# EAGLE schematic Welder_PSU_Backup (EAGLE 9.6.2)

## Sheet 1 of 4
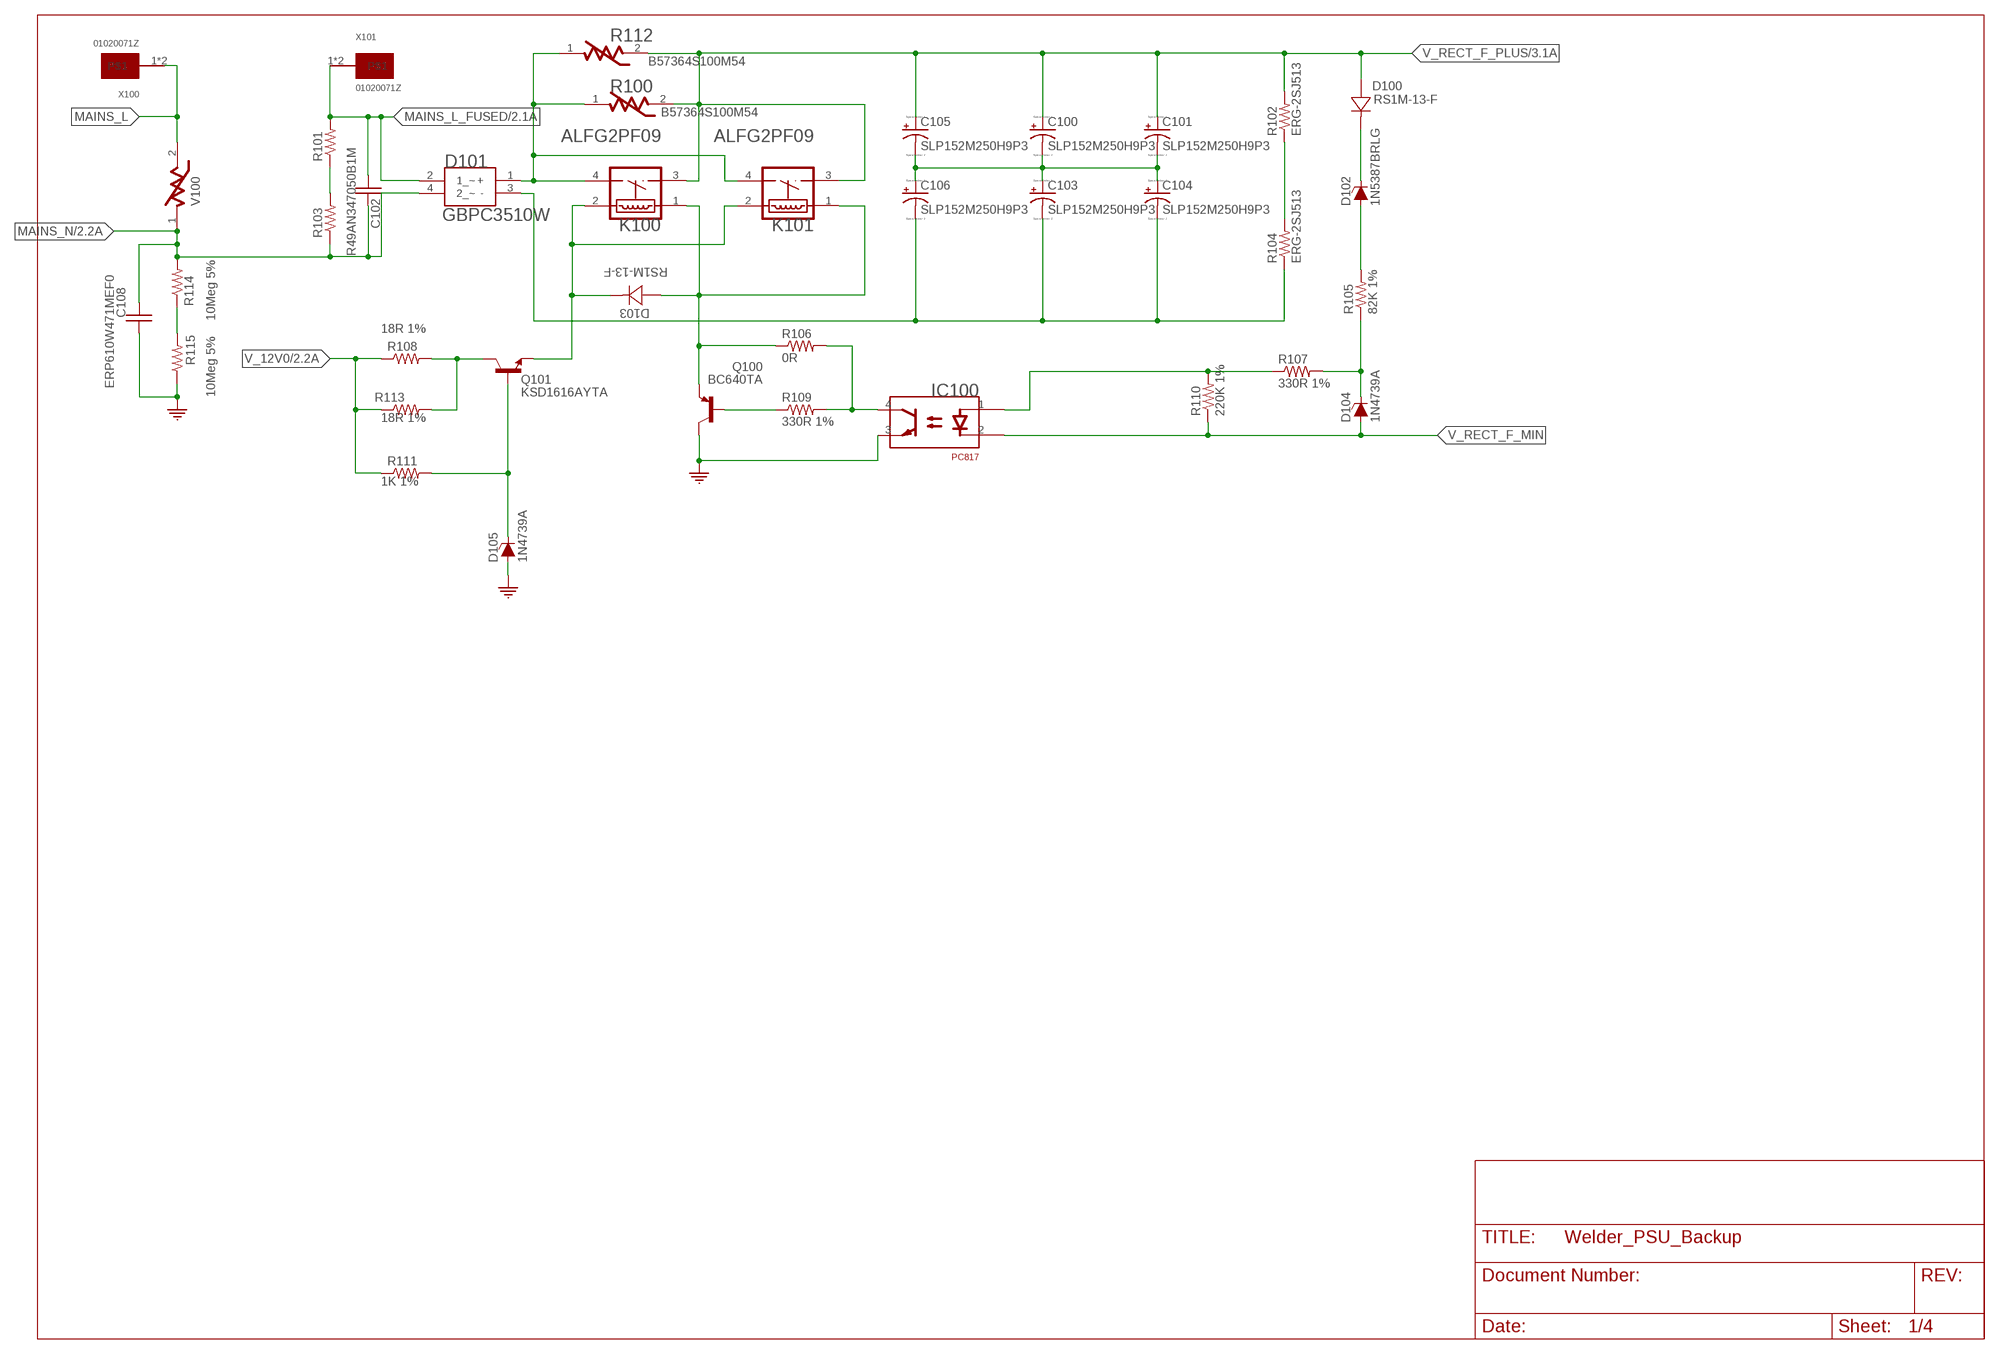
[diagram p0: schematic, sheet 1]

### Parts
C100  SLP152M250H9P3  [CAPACITOR-ELKO-400V-RM10-35X50]
C101  SLP152M250H9P3  [CAPACITOR-ELKO-400V-RM10-35X50]
C102  R49AN347050B1M  [R49AN347050B1M]
C103  SLP152M250H9P3  [CAPACITOR-ELKO-400V-RM10-35X50]
C104  SLP152M250H9P3  [CAPACITOR-ELKO-400V-RM10-35X50]
C105  SLP152M250H9P3  [CAPACITOR-ELKO-400V-RM10-35X50]
C106  SLP152M250H9P3  [CAPACITOR-ELKO-400V-RM10-35X50]
C108  ERP610W471MEF0  [CAP-P12.5-H15-W4-D1]
D100  RS1M-13-F  [SMA-DIODE]
D101  GBPC3510W  [GBPC3510W]
D102  1N5387BRLG  [DO-201AD]
D103  RS1M-13-F  [SMA-DIODE]
D104  1N4739A  [DO-201AD]
D105  1N4739A  [DO-201AD]
IC100  PC817  [DIP04]
K100  PANASONIC_ALFG2PF09PANASONIC_ALFG2PF09_0_0  [PANASONIC_ALFG2PF09_0]
K101  PANASONIC_ALFG2PF09PANASONIC_ALFG2PF09_0_0  [PANASONIC_ALFG2PF09_0]
Q100  BC640TA  [TO-92]
Q101  KSD1616AYTA  [TO-92]
R100  B57364S100M54  [VARISTOR_D25_P7.5]
R101  R_1206EIA1206  [EIA1206]
R102  ERG-2SJ513  [ERG-2S]
R103  R_1206EIA1206  [EIA1206]
R104  ERG-2SJ513  [ERG-2S]
R105  82K 1%  R_2010  [R2010]
R106  0R  R_0603  [EIA0603]
R107  330R 1%  R_0603  [EIA0603]
R108  R_2010EIA2010  [EIA2010]
R109  330R 1%  R_0603  [EIA0603]
R110  220K 1%  R_0603  [EIA0603]
R111  R_1206EIA1206  [EIA1206]
R112  B57364S100M54  [VARISTOR_D25_P7.5]
R113  R_2010EIA2010  [EIA2010]
R114  RNF12FTD10M0  [RES-RM12.5-VR37]
R115  RNF12FTD10M0  [RES-RM12.5-VR37]
V100  B72205S0271K101B72205S2131K101  [EPCOS_B72205S0271K101_0]
X100  01020071Z  [FUSE_CLIP_01020071Z]
X101  01020071Z  [FUSE_CLIP_01020071Z]

### Nets
GND: C108.P$1 D105.A IC100.3(EMITTER) Q100.2(C) R115.1 ; also sheet 2,3,4
MAINS_L: V100.2 X100.1 X100.1-1
MAINS_L_FUSED: C102.2 D101.2(1_~) R101.2 X101.1 X101.1-1 ; also sheet 2
MAINS_N: C102.1 C108.P$2 D101.4(2_~) R103.1 R114.2 V100.1 ; also sheet 2
N$91: R114.1 R115.2
N$93: D101.1(+) K100.4(COM) K101.4(COM) R100.1 R112.1
N$95: D103.C K100.2 K101.2 Q101.1(E)
N$96: R101.1 R103.2
N$97: D103.A K100.1 K101.1 Q100.1(E) R106.1
N$98: Q101.2(C) R108.2 R113.2
N$99: R102.1 R104.2
N$100: Q100.3(B) R109.1
N$101: D105.K(C) Q101.3(B) R111.2
N$102: IC100.4(COLLECTOR) R106.2 R109.2
N$103: C103.2(-) C104.2(-) C106.2(-) D101.3(-) R104.1
N$104: C100.2(-) C101.2(-) C103.1(+) C104.1(+) C105.2(-) C106.1(+)
N$106: D104.K(C) R105.1 R107.2
N$108: D102.A R105.2
N$109: D100.C D102.K(C)
N$110: IC100.1(ANODE) R107.1 R110.2
V_12V0: R108.1 R111.1 R113.1 ; also sheet 2,3
V_RECT_F_MIN: D104.A IC100.2(CATHODE) R110.1
V_RECT_F_PLUS: C100.1(+) C101.1(+) C105.1(+) D100.A K100.3(NO) K101.3(NO) R100.2 R102.2 R112.2 ; also sheet 3

## Sheet 2 of 4
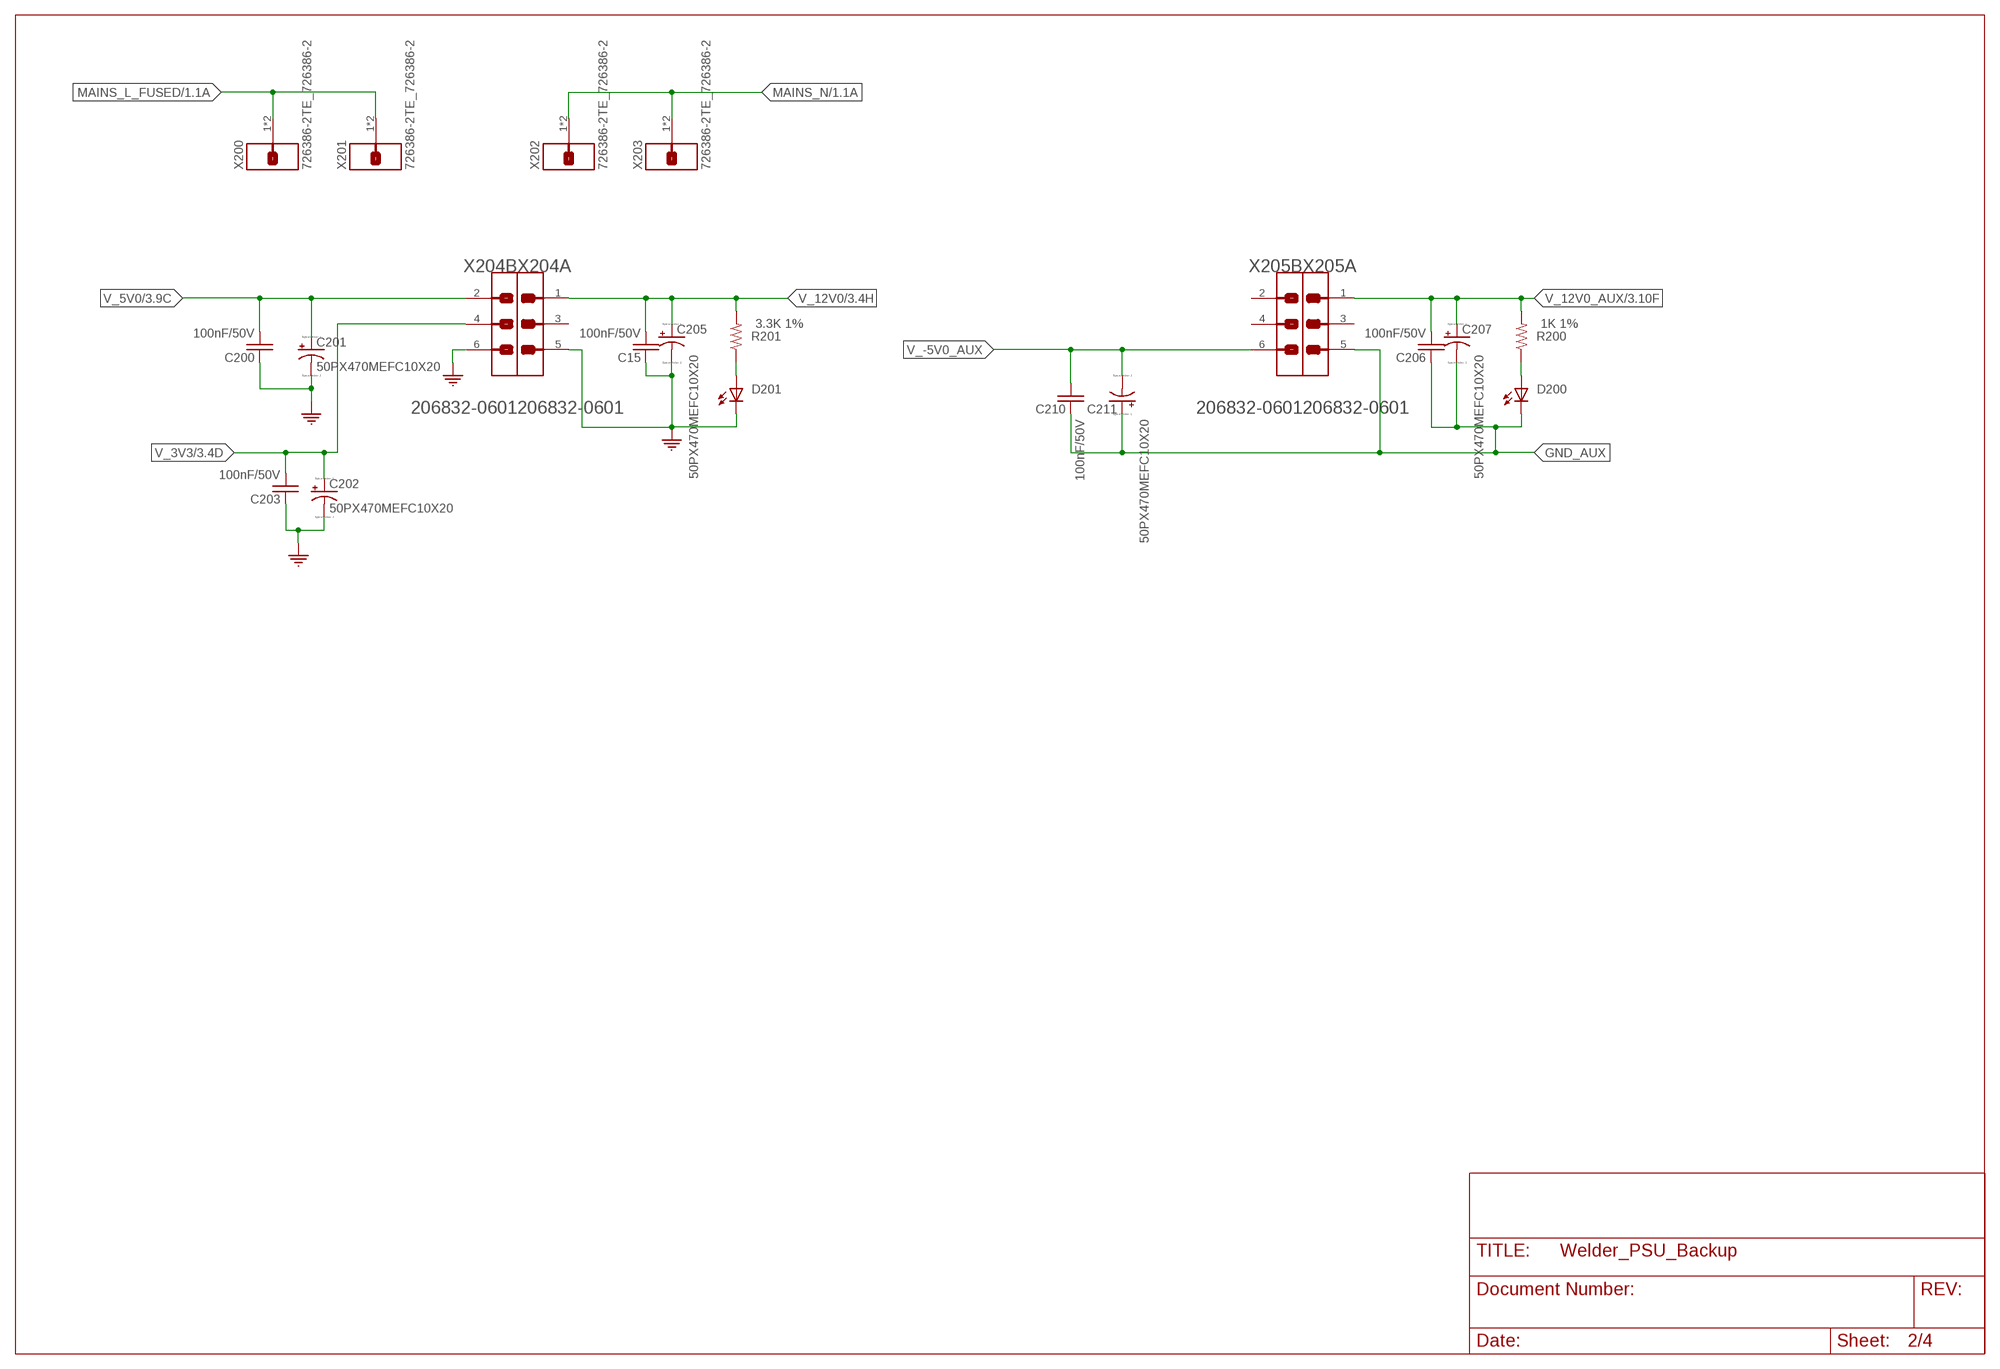
[diagram p1: schematic, sheet 2]

### Parts
C15  100nF/50V  C_0603EIA0603  [EIA0603]
C200  100nF/50V  C_0603EIA0603  [EIA0603]
C201  50PX470MEFC10X20  [CAPACITOR-ELKO-RM5-10X16]
C202  50PX470MEFC10X20  [CAPACITOR-ELKO-RM5-10X16]
C203  100nF/50V  C_0603EIA0603  [EIA0603]
C205  50PX470MEFC10X20  [CAPACITOR-ELKO-RM5-10X16]
C206  100nF/50V  C_0603EIA0603  [EIA0603]
C207  50PX470MEFC10X20  [CAPACITOR-ELKO-RM5-10X16]
C210  100nF/50V  C_0603EIA0603  [EIA0603]
C211  50PX470MEFC10X20  [CAPACITOR-ELKO-RM5-10X16]
D200  26-21/GPC-F3138B/CA  [SMD1206-LED]
D201  26-21/GPC-F3138B/CA  [SMD1206-LED]
R200  1K 1%  R_0603  [EIA0603]
R201  3.3K 1%  R_0603  [EIA0603]
X200  726386-2TE_726386-2  [TE_726386-2]
X201  726386-2TE_726386-2  [TE_726386-2]
X202  726386-2TE_726386-2  [TE_726386-2]
X203  726386-2TE_726386-2  [TE_726386-2]
X204  MOLEX_206832-0601MOLEX_206832-0601  [MOLEX_206832-0601]
X205  MOLEX_206832-0601MOLEX_206832-0601  [MOLEX_206832-0601]

### Nets
GND: C15.1 C200.1 C201.2(-) C202.2(-) C203.1 C205.2(-) D201.2(C) X204.5 X204.6 ; also sheet 1,3,4
GND_AUX: C206.1 C207.2(-) C210.1 C211.1(+) D200.2(C) X205.5
MAINS_L_FUSED: X200.1 X200.1-2 X201.1 X201.1-2 ; also sheet 1
MAINS_N: X202.1 X202.1-2 X203.1 X203.1-2 ; also sheet 1
N$105: D201.1(A) R201.1
N$107: D200.1(A) R200.1
V_3V3: C202.1(+) C203.2 X204.4 ; also sheet 3,4
V_5V0: C200.2 C201.1(+) X204.2 ; also sheet 3
V_12V0: C15.2 C205.1(+) R201.2 X204.1 ; also sheet 1,3
V_12V0_AUX: C206.2 C207.1(+) R200.2 X205.1 ; also sheet 3
V_-5V0_AUX: C210.2 C211.2(-) X205.6
Unconnected: X204.3 X205.2 X205.3 X205.4

## Sheet 3 of 4
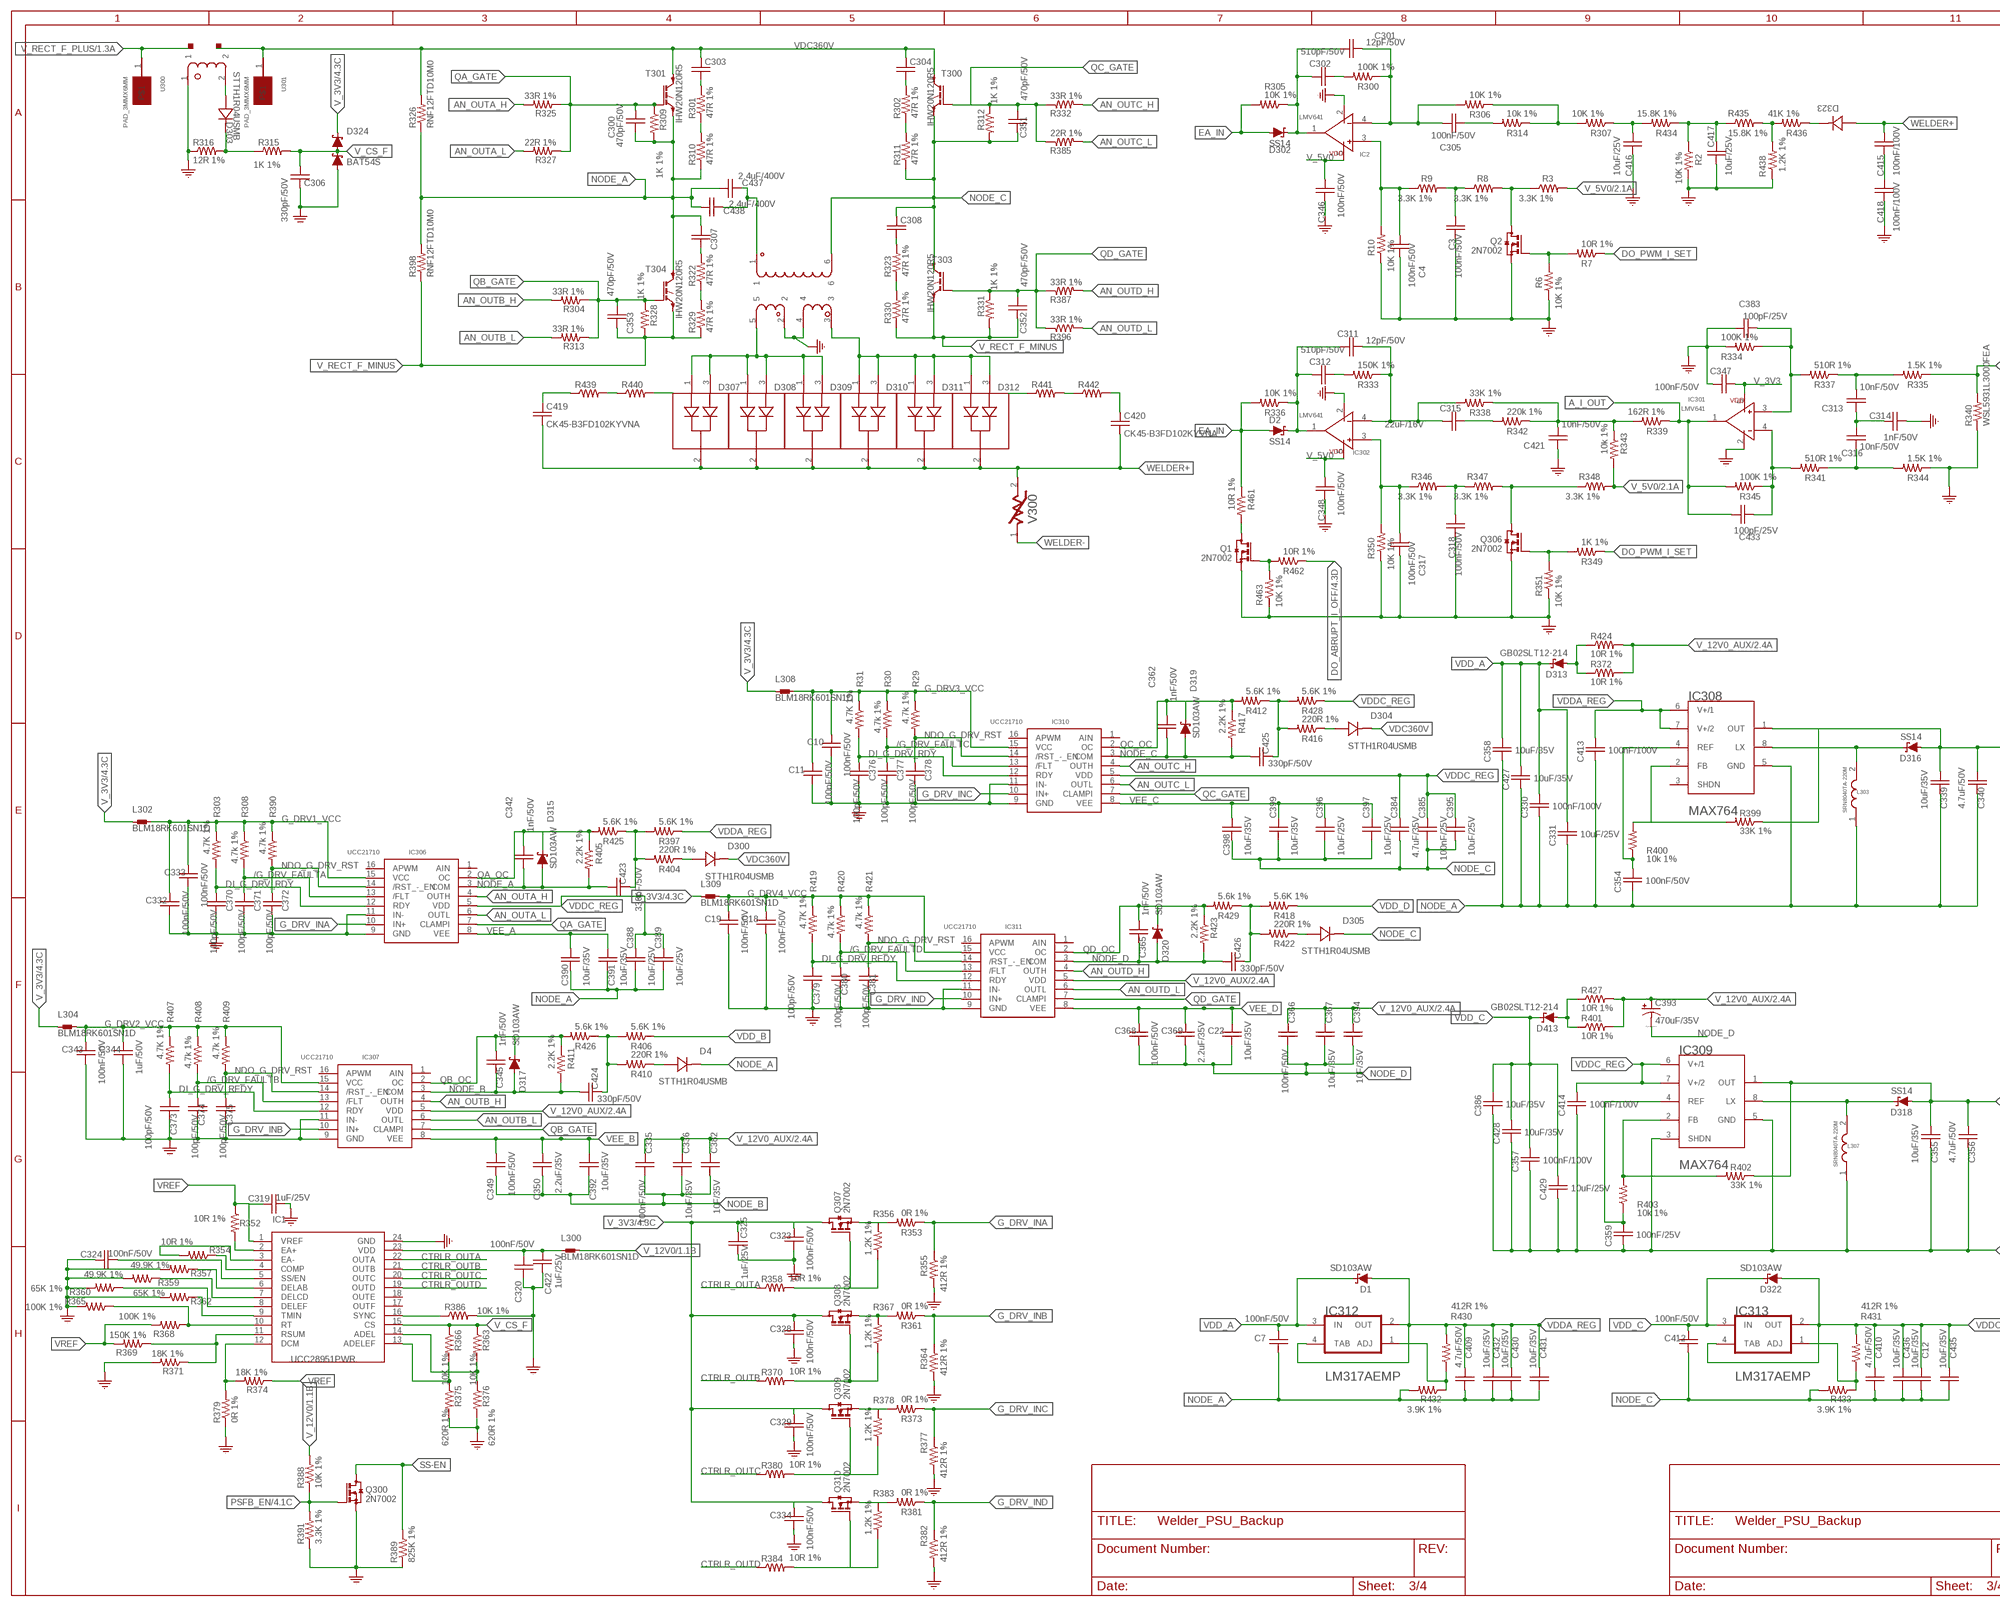
[diagram p2: schematic, sheet 3, part 1 of 2]
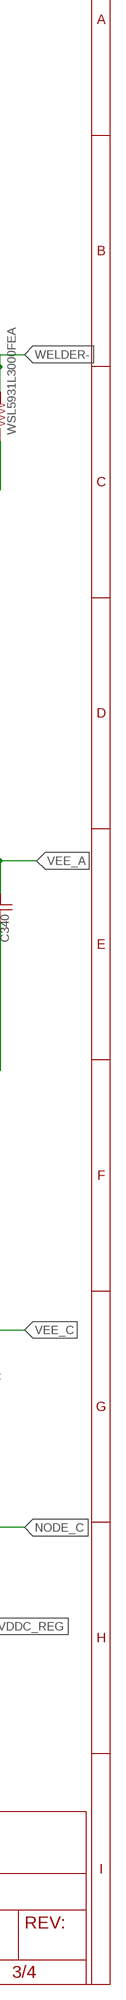
[diagram p3: schematic, sheet 3, part 2 of 2]

### Parts
C3  100nF/50V  C_0603EIA0603  [EIA0603]
C4  100nF/50V  C_0603EIA0603  [EIA0603]
C7  100nF/50V  C_0603EIA0603  [EIA0603]
C10  100nF/50V  C_0603EIA0603  [EIA0603]
C11  100nF/50V  C_0603EIA0603  [EIA0603]
C12  10uF/35V  C_0603EIA0603  [EIA0603]
C18  100nF/50V  C_0603EIA0603  [EIA0603]
C19  100nF/50V  C_0603EIA0603  [EIA0603]
C22  10uF/35V  C_0603EIA0603  [EIA0603]
C300  470pF/50V  C_0603EIA0603  [EIA0603]
C301  12pF/50V  C_0603EIA0603  [EIA0603]
C302  510pF/50V  C_0603EIA0603  [EIA0603]
C303  HVCC153Y6P471MEAX  [CAPACITOR-FILM-RM12.5MM-12MM]
C304  HVCC153Y6P471MEAX  [CAPACITOR-FILM-RM12.5MM-12MM]
C305  100nF/50V  C_0603EIA0603  [EIA0603]
C306  330pF/50V  C_0603EIA0603  [EIA0603]
C307  HVCC153Y6P471MEAX  [CAPACITOR-FILM-RM12.5MM-12MM]
C308  HVCC153Y6P471MEAX  [CAPACITOR-FILM-RM12.5MM-12MM]
C311  12pF/50V  C_0603EIA0603  [EIA0603]
C312  510pF/50V  C_0603EIA0603  [EIA0603]
C313  10nF/50V  C_0603EIA0603  [EIA0603]
C314  1nF/50V  C_0603EIA0603  [EIA0603]
C315  22uF/16V  C_0603EIA0603  [EIA0603]
C316  10nF/50V  C_0603EIA0603  [EIA0603]
C317  100nF/50V  C_0603EIA0603  [EIA0603]
C318  100nF/50V  C_0603EIA0603  [EIA0603]
C319  1uF/25V  C_0603EIA0603  [EIA0603]
C320  100nF/50V  C_0603EIA0603  [EIA0603]
C323  100nF/50V  C_0603EIA0603  [EIA0603]
C324  100nF/50V  C_0603EIA0603  [EIA0603]
C325  1uF/25V  C_0603EIA0603  [EIA0603]
C328  100nF/50V  C_0603EIA0603  [EIA0603]
C329  100nF/50V  C_0603EIA0603  [EIA0603]
C330  100nF/100V  C_0603EIA0603  [EIA0603]
C331  10uF/25V  C_0603EIA0603  [EIA0603]
C332  100nF/50V  C_0603EIA0603  [EIA0603]
C333  100nF/50V  C_0603EIA0603  [EIA0603]
C334  100nF/50V  C_0603EIA0603  [EIA0603]
C335  100nF/50V  C_0603EIA0603  [EIA0603]
C336  10uF/35V  C_0603EIA0603  [EIA0603]
C339  10uF/35V  C_0603EIA0603  [EIA0603]
C340  4.7uF/50V  C_0603EIA0603  [EIA0603]
C342  1nF/50V  C_0603EIA0603  [EIA0603]
C343  100nF/50V  C_0603EIA0603  [EIA0603]
C344  1uF/50V  C_0603EIA0603  [EIA0603]
C345  1nF/50V  C_0603EIA0603  [EIA0603]
C346  100nF/50V  C_0603EIA0603  [EIA0603]
C347  100nF/50V  C_0603EIA0603  [EIA0603]
C348  100nF/50V  C_0603EIA0603  [EIA0603]
C349  100nF/50V  C_0603EIA0603  [EIA0603]
C350  2.2uF/35V  C_0603EIA0603  [EIA0603]
C351  470pF/50V  C_0603EIA0603  [EIA0603]
C352  470pF/50V  C_0603EIA0603  [EIA0603]
C353  470pF/50V  C_0603EIA0603  [EIA0603]
C354  100nF/50V  C_0603EIA0603  [EIA0603]
C355  10uF/35V  C_0603EIA0603  [EIA0603]
C356  4.7uF/50V  C_0603EIA0603  [EIA0603]
C357  100nF/100V  C_0603EIA0603  [EIA0603]
C358  10uF/35V  C_0603EIA0603  [EIA0603]
C359  100nF/25V  C_0603EIA0603  [EIA0603]
C362  1nF/50V  C_0603EIA0603  [EIA0603]
C365  1nF/50V  C_0603EIA0603  [EIA0603]
C366  100nF/50V  C_0603EIA0603  [EIA0603]
C367  10uF/35V  C_0603EIA0603  [EIA0603]
C368  100nF/50V  C_0603EIA0603  [EIA0603]
C369  2.2uF/35V  C_0603EIA0603  [EIA0603]
C370  100pF/50V  C_0603EIA0603  [EIA0603]
C371  100pF/50V  C_0603EIA0603  [EIA0603]
C372  100pF/50V  C_0603EIA0603  [EIA0603]
C373  100pF/50V  C_0603EIA0603  [EIA0603]
C374  100pF/50V  C_0603EIA0603  [EIA0603]
C375  100pF/50V  C_0603EIA0603  [EIA0603]
C376  100pF/50V  C_0603EIA0603  [EIA0603]
C377  100pF/50V  C_0603EIA0603  [EIA0603]
C378  100pF/50V  C_0603EIA0603  [EIA0603]
C379  100pF/50V  C_0603EIA0603  [EIA0603]
C380  100pF/50V  C_0603EIA0603  [EIA0603]
C381  100pF/50V  C_0603EIA0603  [EIA0603]
C382  10F/35V  C_0603EIA0603  [EIA0603]
C383  100pF/25V  C_0603EIA0603  [EIA0603]
C384  4.7uF/35V  C_0603EIA0603  [EIA0603]
C385  100nF/25V  C_0603EIA0603  [EIA0603]
C386  10uF/35V  C_0603EIA0603  [EIA0603]
C388  10uF/25V  C_0603EIA0603  [EIA0603]
C389  10uF/25V  C_0603EIA0603  [EIA0603]
C390  10uF/35V  C_0603EIA0603  [EIA0603]
C391  10uF/35V  C_0603EIA0603  [EIA0603]
C392  10uF/35V  C_0603EIA0603  [EIA0603]
C393  470uF/35V  50PX470MEFC10X20  [CAPACITOR-ELKO-RM5-10X16]
C394  10F/35V  C_0603EIA0603  [EIA0603]
C395  10uF/25V  C_0603EIA0603  [EIA0603]
C396  10uF/25V  C_0603EIA0603  [EIA0603]
C397  10uF/25V  C_0603EIA0603  [EIA0603]
C398  10uF/35V  C_0603EIA0603  [EIA0603]
C399  10uF/35V  C_0603EIA0603  [EIA0603]
C409  4.7uF/50V  C_0603EIA0603  [EIA0603]
C410  4.7uF/50V  C_0603EIA0603  [EIA0603]
C412  100nF/50V  C_0603EIA0603  [EIA0603]
C413  100nF/100V  C_0603EIA0603  [EIA0603]
C414  100nF/100V  C_0603EIA0603  [EIA0603]
C415  100nF/100V  C_0603EIA0603  [EIA0603]
C416  10uF/25V  C_0603EIA0603  [EIA0603]
C417  10uF/25V  C_0603EIA0603  [EIA0603]
C418  100nF/100V  C_0603EIA0603  [EIA0603]
C419  CK45-B3FD102KYVNA  [C_DISC_P7.5D12]
C420  CK45-B3FD102KYVNA  [C_DISC_P7.5D12]
C421  10nF/50V  C_0603EIA0603  [EIA0603]
C422  1uF/25V  C_0603EIA0603  [EIA0603]
C423  330pF/50V  C_0603EIA0603  [EIA0603]
C424  330pF/50V  C_0603EIA0603  [EIA0603]
C425  330pF/50V  C_0603EIA0603  [EIA0603]
C426  330pF/50V  C_0603EIA0603  [EIA0603]
C427  10uF/35V  C_0603EIA0603  [EIA0603]
C428  10uF/35V  C_0603EIA0603  [EIA0603]
C429  10uF/25V  C_0603EIA0603  [EIA0603]
C430  10uF/35V  C_0603EIA0603  [EIA0603]
C431  10uF/35V  C_0603EIA0603  [EIA0603]
C432  10uF/35V  C_0603EIA0603  [EIA0603]
C433  100pF/25V  C_0603EIA0603  [EIA0603]
C435  10uF/35V  C_0603EIA0603  [EIA0603]
C436  10uF/35V  C_0603EIA0603  [EIA0603]
C437  ECW-F4245JLB  [CAPACITOR-FILM-RM17.5-28X17.5X25]
C438  ECW-F4245JLB  [CAPACITOR-FILM-RM17.5-28X17.5X25]
D1  SD103AW  [SOD-323]
D2  SS14  [SMA]
D4  STTH1R04USMB  [SMB]
D300  STTH1R04USMB  [SMB]
D302  SS14  [SMA]
D303  STTH1R04USMB  [SMB]
D304  STTH1R04USMB  [SMB]
D305  STTH1R04USMB  [SMB]
D307  FEP30DP-E3/45TO-247AD  [TO-247AD]
D308  FEP30DP-E3/45TO-247AD  [TO-247AD]
D309  FEP30DP-E3/45TO-247AD  [TO-247AD]
D310  FEP30DP-E3/45TO-247AD  [TO-247AD]
D311  FEP30DP-E3/45TO-247AD  [TO-247AD]
D312  FEP30DP-E3/45TO-247AD  [TO-247AD]
D313  GB02SLT12-214  [SMB]
D315  SD103AW  [SOD-323]
D316  SS14  [SMA]
D317  SD103AW  [SOD-323]
D318  SS14  [SMA]
D319  SD103AW  [SOD-323]
D320  SD103AW  [SOD-323]
D322  SD103AW  [SOD-323]
D323  STTH1R04USMB  [SMB]
D324  BAT54S  [SOT23DUALDIODE]
D413  GB02SLT12-214  [SMB]
IC1  UCC28951PWR  [TSSOP24]
IC2  LMV641  [SOT-23-5]
IC301  LMV641  [SOT-23-5]
IC302  LMV641  [SOT-23-5]
IC306  UCC21710  [SOIC16_WIDE_HV]
IC307  UCC21710  [SOIC16_WIDE_HV]
IC308  MAX764CSA+  [SOIC8]
IC309  MAX764CSA+  [SOIC8]
IC310  UCC21710  [SOIC16_WIDE_HV]
IC311  UCC21710  [SOIC16_WIDE_HV]
IC312  LM317AEMP  [SOT223_LM317AEMP]
IC313  LM317AEMP  [SOT223_LM317AEMP]
L300  BLM18RK601SN1D  [0603]
L302  BLM18RK601SN1D  [0603]
L303  SRN8040TA-220M  [SRN8040TA-220M]
L304  BLM18RK601SN1D  [0603]
L307  SRN8040TA-220M  [SRN8040TA-220M]
L308  BLM18RK601SN1D  [0603]
L309  BLM18RK601SN1D  [0603]
Q1  2N7002  [SOT23]
Q2  2N7002  [SOT23]
Q300  2N7002  [SOT23]
Q306  2N7002  [SOT23]
Q307  2N7002  [SOT23]
Q308  2N7002  [SOT23]
Q309  2N7002  [SOT23]
Q310  2N7002  [SOT23]
R2  10K 1%  R_0603  [EIA0603]
R3  3.3K 1%  R_0603  [EIA0603]
R6  10K 1%  R_0603  [EIA0603]
R7  10R 1%  R_0603  [EIA0603]
R8  3.3K 1%  R_0603  [EIA0603]
R9  3.3K 1%  R_0603  [EIA0603]
R10  10K 1%  R_0603  [EIA0603]
R29  4.7k 1%  R_0603  [EIA0603]
R30  4.7k 1%  R_0603  [EIA0603]
R31  4.7K 1%  R_0603  [EIA0603]
R300  100K 1%  R_0603  [EIA0603]
R301  47R 1%  R-US_R2512  [R2512]
R302  47R 1%  R-US_R2512  [R2512]
R303  4.7K 1%  R_0603  [EIA0603]
R304  33R 1%  R_2010EIA2010  [EIA2010]
R305  10K 1%  R_0603  [EIA0603]
R306  10K 1%  R_0603  [EIA0603]
R307  10K 1%  R_0603  [EIA0603]
R308  4.7k 1%  R_0603  [EIA0603]
R309  1K 1%  R_0603  [EIA0603]
R310  47R 1%  R-US_R2512  [R2512]
R311  47R 1%  R-US_R2512  [R2512]
R312  1K 1%  R_0603  [EIA0603]
R313  33R 1%  R_2010EIA2010  [EIA2010]
R314  10k 1%  R_0603  [EIA0603]
R315  1K 1%  R_0603  [EIA0603]
R316  12R 1%  R_2512  [EIA2512]
R322  47R 1%  R-US_R2512  [R2512]
R323  47R 1%  R-US_R2512  [R2512]
R325  33R 1%  R_2010EIA2010  [EIA2010]
R326  RNF12FTD10M0  [RES-RM12.5-VR37]
R327  22R 1%  R_2010EIA2010  [EIA2010]
R328  1K 1%  R_0603  [EIA0603]
R329  47R 1%  R-US_R2512  [R2512]
R330  47R 1%  R-US_R2512  [R2512]
R331  1K 1%  R_0603  [EIA0603]
R332  33R 1%  R_2010EIA2010  [EIA2010]
R333  150K 1%  R_0603  [EIA0603]
R334  100K 1%  R_0603  [EIA0603]
R335  1.5K 1%  R_0603  [EIA0603]
R336  10K 1%  R_0603  [EIA0603]
R337  510R 1%  R_0603  [EIA0603]
R338  33K 1%  R_0603  [EIA0603]
R339  162R 1%  R_0603  [EIA0603]
R340  WSL5931L3000FEA  [WSLP3921]
R341  510R 1%  R_0603  [EIA0603]
R342  220k 1%  R_0603  [EIA0603]
R343  10k 1%  R_0603  [EIA0603]
R344  1.5K 1%  R_0603  [EIA0603]
R345  100K 1%  R_0603  [EIA0603]
R346  3.3K 1%  R_0603  [EIA0603]
R347  3.3K 1%  R_0603  [EIA0603]
R348  3.3K 1%  R_0603  [EIA0603]
R349  1K 1%  R_0603  [EIA0603]
R350  10K 1%  R_0603  [EIA0603]
R351  10K 1%  R_0603  [EIA0603]
R352  10R 1%  R_0603  [EIA0603]
R353  0R 1%  R_0603  [EIA0603]
R354  10R 1%  R_0603  [EIA0603]
R355  412R 1%  R_0603  [EIA0603]
R356  1.2K 1%  R_0603  [EIA0603]
R357  49.9K 1%  R_0603  [EIA0603]
R358  10R 1%  R_0603  [EIA0603]
R359  49.9K 1%  R_0603  [EIA0603]
R360  65K 1%  R_0603  [EIA0603]
R361  0R 1%  R_0603  [EIA0603]
R362  65K 1%  R_0603  [EIA0603]
R363  10K 1%  R_0603  [EIA0603]
R364  412R 1%  R_0603  [EIA0603]
R365  100K 1%  R_0603  [EIA0603]
R366  10K 1%  R_0603  [EIA0603]
R367  1.2K 1%  R_0603  [EIA0603]
R368  100K 1%  R_0603  [EIA0603]
R369  150K 1%  R_0603  [EIA0603]
R370  10R 1%  R_0603  [EIA0603]
R371  18K 1%  R_0603  [EIA0603]
R372  10R 1%  R_2512  [EIA2512]
R373  0R 1%  R_0603  [EIA0603]
R374  18K 1%  R_0603  [EIA0603]
R375  620R 1%  R_0603  [EIA0603]
R376  620R 1%  R_0603  [EIA0603]
R377  412R 1%  R_0603  [EIA0603]
R378  1.2K 1%  R_0603  [EIA0603]
R379  0R 1%  R_0603  [EIA0603]
R380  10R 1%  R_0603  [EIA0603]
R381  0R 1%  R_0603  [EIA0603]
R382  412R 1%  R_0603  [EIA0603]
R383  1.2K 1%  R_0603  [EIA0603]
R384  10R 1%  R_0603  [EIA0603]
R385  22R 1%  R_2010EIA2010  [EIA2010]
R386  10K 1%  R_0603  [EIA0603]
R387  33R 1%  R_2010EIA2010  [EIA2010]
R388  10K 1%  R_0603  [EIA0603]
R389  825K 1%  R_0603  [EIA0603]
R390  4.7k 1%  R_0603  [EIA0603]
R391  3.3K 1%  R_0603  [EIA0603]
R396  33R 1%  R_2010EIA2010  [EIA2010]
R397  5.6K 1%  R_0603  [EIA0603]
R398  RNF12FTD10M0  [RES-RM12.5-VR37]
R399  33K 1%  R_0603  [EIA0603]
R400  10k 1%  R_0603  [EIA0603]
R401  10R 1%  R_2512  [EIA2512]
R402  33K 1%  R_0603  [EIA0603]
R403  10k 1%  R_0603  [EIA0603]
R404  220R 1%  R_0603  [EIA0603]
R405  2.2K 1%  R_0603  [EIA0603]
R406  5.6K 1%  R_0603  [EIA0603]
R407  4.7K 1%  R_0603  [EIA0603]
R408  4.7k 1%  R_0603  [EIA0603]
R409  4.7k 1%  R_0603  [EIA0603]
R410  220R 1%  R_0603  [EIA0603]
R411  2.2K 1%  R_0603  [EIA0603]
R412  5.6K 1%  R_0603  [EIA0603]
R416  220R 1%  R_0603  [EIA0603]
R417  2.2K 1%  R_0603  [EIA0603]
R418  5.6K 1%  R_0603  [EIA0603]
R419  4.7K 1%  R_0603  [EIA0603]
R420  4.7k 1%  R_0603  [EIA0603]
R421  4.7k 1%  R_0603  [EIA0603]
R422  220R 1%  R_0603  [EIA0603]
R423  2.2K 1%  R_0603  [EIA0603]
R424  10R 1%  R_2512  [EIA2512]
R425  5.6K 1%  R_0603  [EIA0603]
R426  5.6k 1%  R_0603  [EIA0603]
R427  10R 1%  R_2512  [EIA2512]
R428  5.6K 1%  R_0603  [EIA0603]
R429  5.6k 1%  R_0603  [EIA0603]
R430  412R 1%  R_0603  [EIA0603]
R431  412R 1%  R_0603  [EIA0603]
R432  3.9K 1%  R_0603  [EIA0603]
R433  3.9K 1%  R_0603  [EIA0603]
R434  15.8K 1%  R_0603  [EIA0603]
R435  15.8K 1%  R_0603  [EIA0603]
R436  41K 1%  R_0603  [EIA0603]
R438  1.2K 1%  R_0603  [EIA0603]
R439  RR02J22RTB  [RES-RM15-RSF1W]
R440  RR02J22RTB  [RES-RM15-RSF1W]
R441  RR02J22RTB  [RES-RM15-RSF1W]
R442  RR02J22RTB  [RES-RM15-RSF1W]
R461  10R 1%  R_0603  [EIA0603]
R462  10R 1%  R_0603  [EIA0603]
R463  10K 1%  R_0603  [EIA0603]
T1  CST206-2A  [CST206-2A]
T300  IHW20N120R5  [TO-247AC]
T301  IHW20N120R5  [TO-247AC]
T303  IHW20N120R5  [TO-247AC]
T304  IHW20N120R5  [TO-247AC]
TR305  11-0060-A  [11-0060-A]
U300  PAD_3MMX6MM  [PAD-3.0X6.0MM]
U301  PAD_3MMX6MM  [PAD-3.0X6.0MM]
V300  B72205S0271K101B72205S2131K101  [EPCOS_B72205S0271K101_0]

### Nets
/G_DRV_FAULTA: C371.2 IC306.13(/FLT) R308.2
/G_DRV_FAULTB: C374.2 IC307.13(/FLT) R408.2
/G_DRV_FAULTC: C377.2 IC310.13(/FLT) R30.2
/G_DRV_FAULTD: C380.2 IC311.13(/FLT) R420.2
A_I_OUT: C433.2 IC301.1(OUT) R339.1 R345.2
AN_OUTA_H: IC306.4(OUTH) R325.2
AN_OUTA_L: IC306.6(OUTL) R327.2
AN_OUTB_H: IC307.4(OUTH) R304.2
AN_OUTB_L: IC307.6(OUTL) R313.2
AN_OUTC_H: IC310.4(OUTH) R332.2
AN_OUTC_L: IC310.6(OUTL) R385.2
AN_OUTD_H: IC311.4(OUTH) R387.2
AN_OUTD_L: IC311.6(OUTL) R396.2
CTRLR_OUTA: IC1.22(OUTA) R358.1
CTRLR_OUTB: IC1.21(OUTB) R370.1
CTRLR_OUTC: IC1.20(OUTC) R380.1
CTRLR_OUTD: IC1.19(OUTD) R384.1
DI_G_DRV_RDY: C370.2 C376.2 IC306.12(RDY) IC310.12(RDY) R31.2 R303.2 ; also sheet 4
DI_G_DRV_REDY: C373.2 C379.2 IC307.12(RDY) IC311.12(RDY) R407.2 R419.2
DO_ABRUPT_I_OFF: R462.1 ; also sheet 4
DO_PWM_I_SET: R7.1 R349.1
EA_IN: D2.2(A) D302.2(A) R305.2 R336.2 R461.1
G_DRV1_VCC: C332.2 C333.2 IC306.15(VCC) L302.2 R303.1 R308.1 R390.1
G_DRV2_VCC: C343.2 C344.2 IC307.15(VCC) L304.2 R407.1 R408.1 R409.1
G_DRV3_VCC: C10.2 C11.2 IC310.15(VCC) L308.2 R29.1 R30.1 R31.1
G_DRV4_VCC: C18.2 C19.2 IC311.15(VCC) L309.2 R419.1 R420.1 R421.1
G_DRV_INA: IC306.10(IN+) R353.1 R355.1
G_DRV_INB: IC307.10(IN+) R361.1 R364.1
G_DRV_INC: IC310.10(IN+) R373.1 R377.1
G_DRV_IND: IC311.10(IN+) R381.1 R382.1
GND: C10.1 C11.1 C18.1 C19.1 C306.1 C314.2 C317.2 C318.2 C319.2 C320.1 C323.1 C324.1 C325.2 C328.1 C329.1 C332.1 C333.1 C334.1 C343.1 C344.1 C347.2 C348.2 C370.1 C371.1 C372.1 C373.1 C374.1 C375.1 C376.1 C377.1 C378.1 C379.1 C380.1 C381.1 C383.1 C416.2 C417.2 C418.2 C421.1 C422.2 D324.1(A1) IC1.24(GND) IC301.2(VEE) IC302.2(VEE) IC306.9(GND) IC306.11(IN-) IC307.9(GND) IC307.11(IN-) IC310.9(GND) IC310.11(IN-) IC311.9(GND) IC311.11(IN-) Q1.2(S) Q300.2(S) Q306.2(S) R2.2 R316.1 R334.2 R340.1 R344.1 R350.1 R351.1 R355.2 R357.2 R359.2 R360.2 R362.2 R364.2 R365.2 R371.2 R375.2 R376.2 R377.2 R379.1 R382.2 R386.2 R389.1 R391.1 R438.1 R463.1 T1.1 TR305.2 TR305.4 ; also sheet 1,2,4
GND1: C3.2 C4.2 C346.2 IC2.2(VEE) Q2.2(S) R6.1 R10.1 ; supply symbol labelled GND
N$1: C311.1 C315.2 IC302.4(IN-) R333.1 R338.2
N$2: IC1.12(DCM) R374.2 R379.2
N$3: IC1.11(RSUM) R369.1 R371.1
N$4: IC1.10(RT) R365.1 R368.1
N$5: IC1.9(TMIN) R362.1
N$6: IC1.8(DELEF) R360.1
N$7: IC1.6(DELAB) R357.1
N$8: IC1.7(DELCD) R359.1
N$9: IC1.4(COMP) R354.1
N$10: IC1.3(EA-) R354.2
N$11: C324.2 IC1.5(SS/EN)
N$12: IC1.2(EA+) R352.2
N$13: C320.2 C422.1 IC1.23(VDD) L300.1
N$14: IC1.16(SYNC) R386.1
N$15: D303.K(C) R315.1 R316.2
N$16: Q307.1(G) R356.1 R358.2
N$17: IC1.13(ADELEF) R366.2 R375.1
N$18: Q307.2(S) R353.2 R356.2
N$19: IC1.14(ADEL) R363.2 R376.1
N$20: C421.2 R338.1 R339.2 R342.1 R343.1
N$21: D303.A T1.2
N$22: Q309.1(G) R378.1 R380.2
N$23: Q309.2(S) R373.2 R378.2
N$24: C313.2 R335.2 R337.1
N$25: C313.1 C314.1 C316.2
N$26: C316.1 R341.1 R344.2
N$27: Q308.1(G) R367.1 R370.2
N$28: Q308.2(S) R361.2 R367.2
N$29: R323.1 R330.2
N$30: C433.1 IC301.4(IN-) R341.2 R345.1
N$31: Q306.1(G) R349.2 R351.2
N$32: C383.2 IC301.3(IN+) R334.1 R337.2
N$33: Q310.1(G) R383.1 R384.2
N$34: R301.1 R310.2
N$35: Q310.2(S) R381.2 R383.2
N$36: C303.2 R301.2
N$37: C315.1 R342.2
N$38: Q1.1(G) R462.2 R463.2
N$39: Q306.3(D) R347.2 R348.1
N$40: R302.1 R311.2
N$41: C304.2 R302.2
N$42: C352.1 R330.1 R331.2 T303.3(S)
N$43: R322.1 R329.2
N$44: C307.2 R322.2
N$45: C308.2 R323.2
N$46: C318.1 R346.2 R347.1
N$47: C437.2 C438.2 TR305.1
N$48: D310.1 D310.3 D311.1 D311.3 D312.1 D312.3 TR305.3
N$49: D307.1 D307.3 D308.1 D308.3 D309.1 D309.3 TR305.5
N$50: R440.2
N$51: R439.2 R440.1
N$52: C419.1 R439.1
N$53: C420.1 R442.2
N$54: R441.1
N$55: R441.2 R442.1
N$56: D413.A R401.1 R427.1
N$57: C317.1 IC302.3(IN+) R346.1 R350.2
N$58: IC309.2(FB) R402.2 R403.2
N$59: C423.2 R397.2 R404.2 R425.1
N$60: IC312.1(ADJ) R430.1 R432.1
N$61: C359.1 IC309.4(REF) R403.1
N$62: IC313.1(ADJ) R431.1 R433.1
N$63: D318.1(C) IC309.8(LX) L307.2
N$64: D316.1(C) IC308.8(LX) L303.2
N$65: C354.1 IC308.4(REF) R400.1
N$66: IC308.2(FB) R399.2 R400.2
N$67: C396.2 C397.2
N$68: D300.A R404.1
N$69: C424.2 R406.2 R410.2 R426.1
N$70: D313.A R372.1 R424.1
N$71: C425.2 R412.1 R416.2 R428.2
N$72: D304.A R416.1
N$73: D4.A R410.1
N$74: C312.1 R333.2
N$75: R306.1 R307.2 R314.1
N$76: Q1.3(D) R461.2
N$77: C311.2 C312.2 D2.1(C) IC302.1(OUT) R336.1
N$78: C305.1 R314.2
N$79: Q2.1(G) R6.2 R7.2
N$80: Q2.3(D) R3.1 R8.2
N$81: C3.1 R8.1 R9.2
N$82: C4.1 IC2.3(IN+) R9.1 R10.2
N$83: C426.2 R418.2 R422.2 R429.1
N$84: D305.A R422.1
N$85: C301.1 C305.2 IC2.4(IN-) R300.1 R306.2
N$86: C302.1 R300.2
N$87: C301.2 C302.2 D302.1(C) IC2.1(OUT) R305.1
N$88: C416.1 R307.1 R434.2
N$89: C417.1 R2.1 R434.1 R435.1
N$90: R435.2 R436.2 R438.2
N$92: D323.K(C) R436.1
N$94: C415.2 C418.1
NDO_G_DRV_RST: C372.2 C375.2 C378.2 C381.2 IC306.14(/RST_-_EN) IC307.14(/RST_-_EN) IC310.14(/RST_-_EN) IC311.14(/RST_-_EN) R29.2 R390.2 R409.2 R421.2 ; also sheet 4
NODE_A: C7.1 C300.1 C307.1 C330.2 C331.2 C339.1 C340.1 C342.1 C354.2 C358.2 C388.1 C389.1 C390.1 C391.1 C409.1 C413.2 C423.1 C427.2 C430.1 C431.1 C432.1 C437.1 C438.1 D4.K(C) D315.A IC306.3(COM) IC308.5(GND) L303.1 R309.2 R310.1 R326.1 R398.2 R405.2 R432.2 T301.3(S) T304.2(D)
NODE_B: C335.1 C336.1 C345.1 C349.1 C350.1 C382.1 C392.1 C424.1 D317.A IC307.3(COM) R411.2
NODE_C: C12.1 C308.1 C351.1 C355.1 C356.1 C357.2 C359.2 C362.1 C384.1 C385.1 C386.2 C395.1 C396.1 C397.1 C398.1 C399.1 C410.1 C412.1 C414.2 C425.1 C428.2 C429.2 C435.1 C436.1 D305.K(C) D319.A IC309.3(SHDN) IC309.5(GND) IC310.3(COM) L307.1 R311.1 R312.2 R417.2 R433.2 T300.3(S) T303.2(D) TR305.6
NODE_D: C22.1 C365.1 C366.1 C367.1 C368.1 C369.1 C393.2(-) C394.1 C426.1 D320.A IC311.3(COM) R423.2
PSFB_EN: Q300.1(G) R388.1 R391.2 ; also sheet 4
QA_GATE: C300.2 IC306.7(CLAMPI) R309.1 R325.1 R327.1 T301.1(G)
QA_OC: C342.2 D315.C IC306.2(OC) R405.1 R425.2
QB_GATE: C353.2 IC307.7(CLAMPI) R304.1 R313.1 R328.1 T304.1(G)
QB_OC: C345.2 D317.C IC307.2(OC) R411.1 R426.2
QC_GATE: C351.2 IC310.7(CLAMPI) R312.1 R332.1 R385.1 T300.1(G)
QC_OC: C362.2 D319.C IC310.2(OC) R412.2 R417.1
QD_GATE: C352.2 IC311.7(CLAMPI) R331.1 R387.1 R396.1 T303.1(G)
QD_OC: C365.2 D320.C IC311.2(OC) R423.1 R429.2
SS-EN: Q300.3(D) R389.2
V_3V3: C323.2 C325.1 C328.2 C329.2 C334.2 C347.1 D324.3(C2) IC301.5(VCC) L302.1 L304.1 L308.1 L309.1 Q307.3(D) Q308.3(D) Q309.3(D) Q310.3(D) ; also sheet 2,4
V_5V0: C346.1 C348.1 IC2.5(VCC) IC302.5(VCC) R3.2 R343.2 R348.2 ; also sheet 2
V_12V0: L300.2 R388.2 ; also sheet 1,2
V_12V0_AUX: C335.2 C336.2 C366.2 C367.2 C382.2 C393.1(+) C394.2 IC307.5(VDD) IC311.5(VDD) R372.2 R401.2 R424.2 R427.2 ; also sheet 2
V_CS_F: C306.2 D324.2(C1_A2) IC1.15(CS) R315.2 R363.1 R366.1
V_RECT_F_MINUS: C353.1 R328.2 R329.1 R398.1 T304.3(S)
V_RECT_F_PLUS: U300.1 ; also sheet 1
VDC360V: C303.1 C304.1 D300.K(C) D304.K(C) R326.2 T300.2(D) T301.2(D) U301.1
VDD_A: C7.2 C330.1 C331.1 C358.1 C427.1 D1.C D313.K(C) IC312.3(IN)
VDD_B: R406.1
VDD_C: C357.1 C386.1 C412.2 C428.1 C429.1 D322.C D413.K(C) IC313.3(IN)
VDD_D: R418.1
VDDA_REG: C409.2 C413.1 C430.2 C431.2 C432.2 D1.A IC308.6(V+/1) IC308.7(V+/2) IC312.2(OUT) IC312.4(TAB) R397.1 R430.2
VDDC_REG: C12.2 C384.2 C385.2 C388.2 C389.2 C395.2 C410.2 C414.1 C435.2 C436.2 D322.A IC306.5(VDD) IC309.6(V+/1) IC309.7(V+/2) IC310.5(VDD) IC313.2(OUT) IC313.4(TAB) R428.1 R431.2
VEE_A: C339.2 C340.2 C390.2 C391.2 D316.2(A) IC306.8(VEE) IC308.1(OUT) R399.1
VEE_B: C349.2 C350.2 C392.2 IC307.8(VEE)
VEE_C: C355.2 C356.2 C398.2 C399.2 D318.2(A) IC309.1(OUT) IC310.8(VEE) R402.1
VEE_D: C22.2 C368.2 C369.2 IC311.8(VEE)
VREF: C319.1 IC1.1(VREF) R352.1 R368.2 R369.2 R374.1
WELDER+: C415.1 C419.2 C420.2 D307.2 D308.2 D309.2 D310.2 D311.2 D312.2 D323.A V300.2
WELDER-: R335.1 R340.2 V300.1
Unconnected: IC1.17(OUTF) IC1.18(OUTE) IC306.1(AIN) IC306.16(APWM) IC307.1(AIN) IC307.16(APWM) IC308.3(SHDN) IC310.1(AIN) IC310.16(APWM) IC311.1(AIN) IC311.16(APWM)

## Sheet 4 of 4
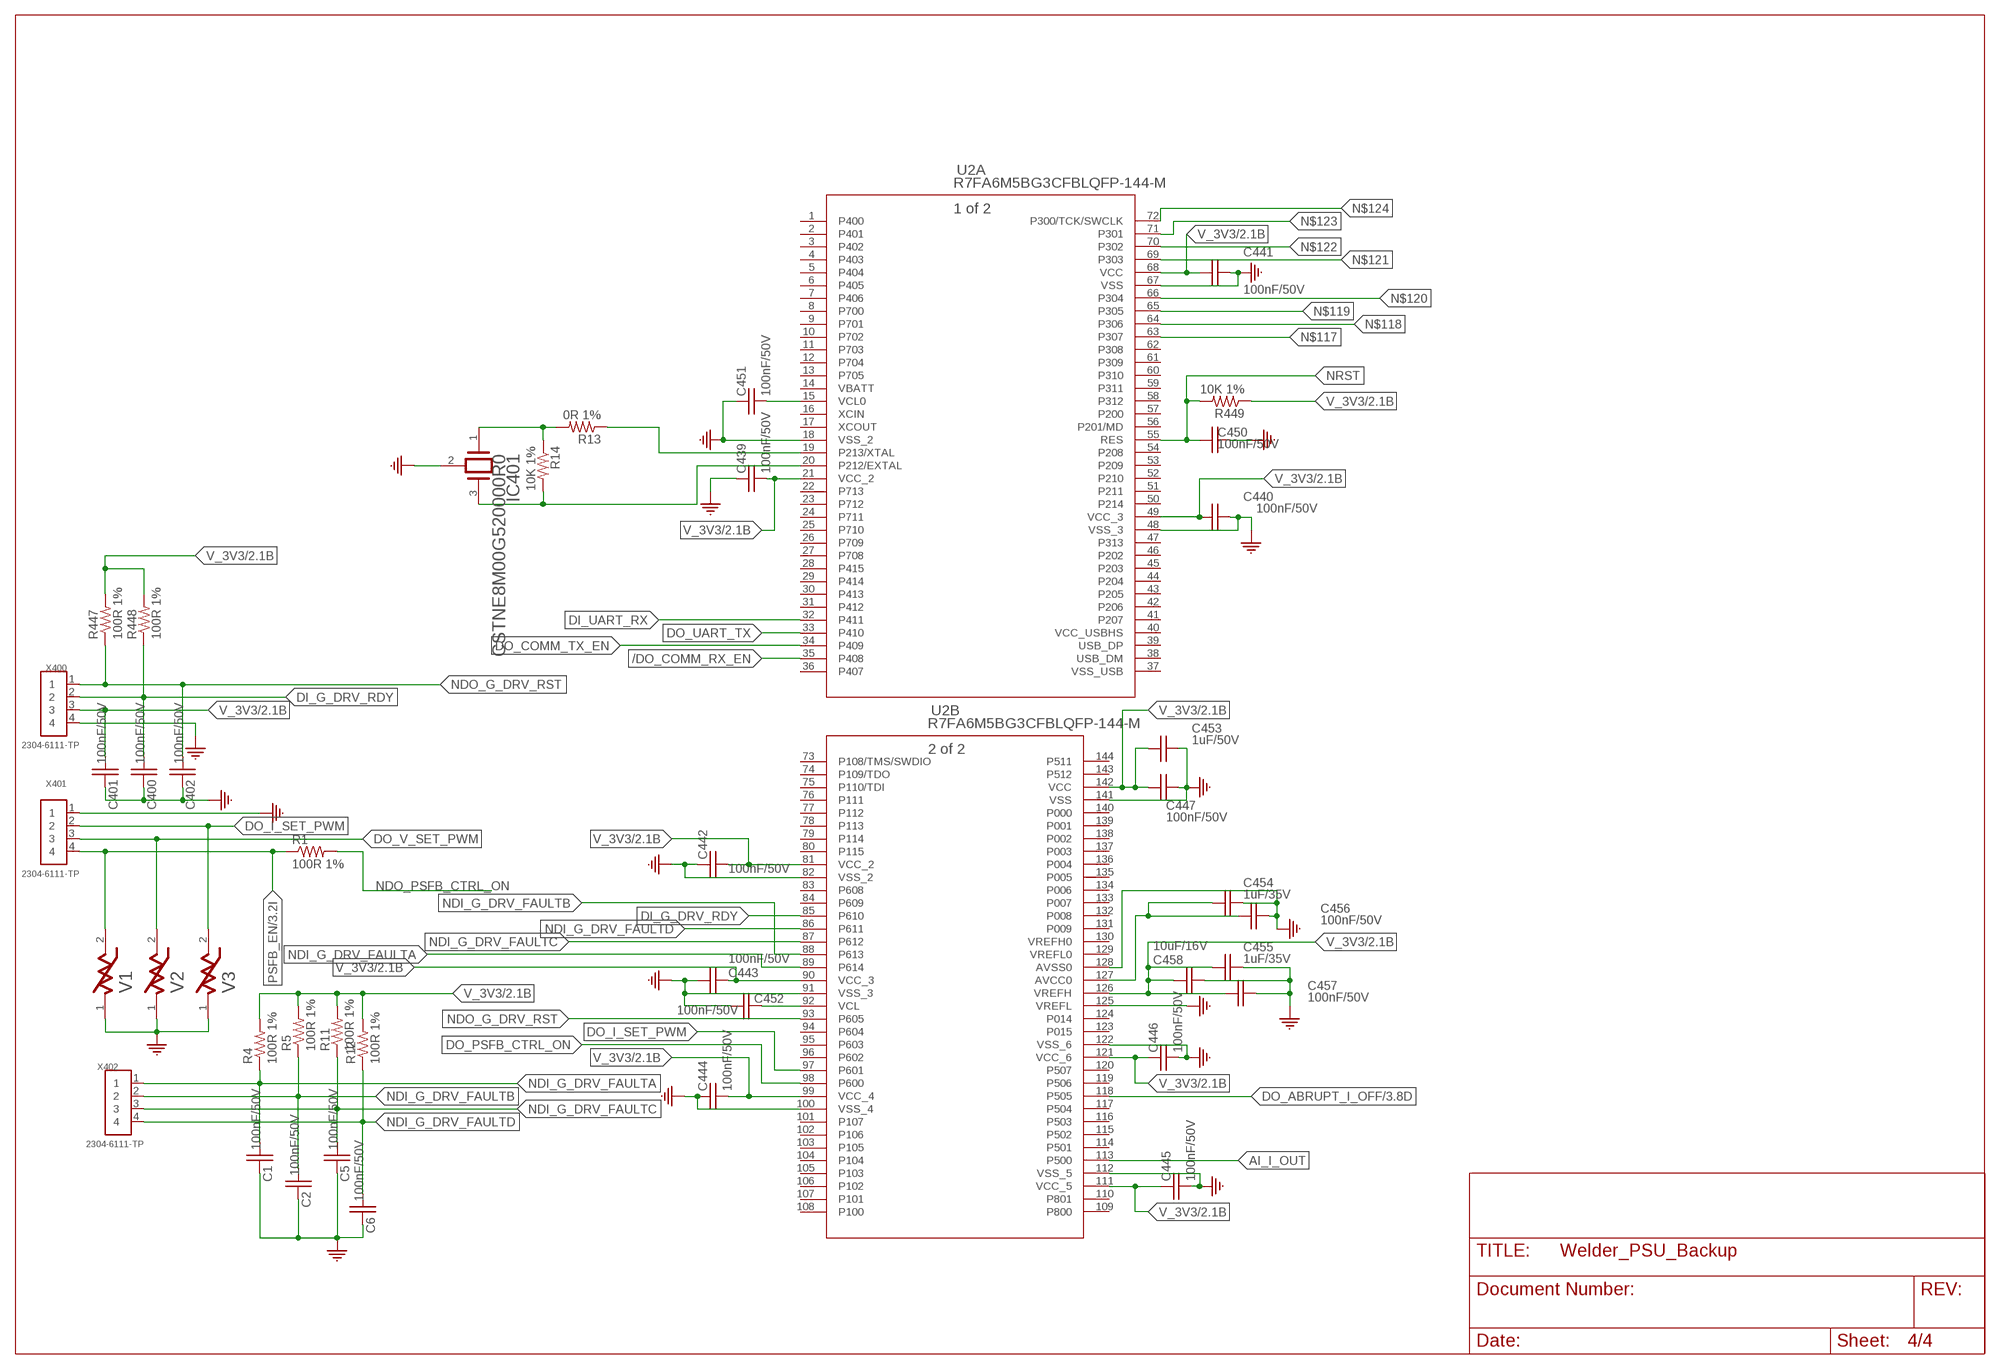
[diagram p4: schematic, sheet 4]

### Parts
C1  100nF/50V  C_0603EIA0603  [EIA0603]
C2  100nF/50V  C_0603EIA0603  [EIA0603]
C5  100nF/50V  C_0603EIA0603  [EIA0603]
C6  100nF/50V  C_0603EIA0603  [EIA0603]
C400  100nF/50V  C_0603EIA0603  [EIA0603]
C401  100nF/50V  C_0603EIA0603  [EIA0603]
C402  100nF/50V  C_0603EIA0603  [EIA0603]
C439  100nF/50V  C_0603EIA0603  [EIA0603]
C440  100nF/50V  C_0603EIA0603  [EIA0603]
C441  100nF/50V  C_0603EIA0603  [EIA0603]
C442  100nF/50V  C_0603EIA0603  [EIA0603]
C443  100nF/50V  C_0603EIA0603  [EIA0603]
C444  100nF/50V  C_0603EIA0603  [EIA0603]
C445  100nF/50V  C_0603EIA0603  [EIA0603]
C446  100nF/50V  C_0603EIA0603  [EIA0603]
C447  100nF/50V  C_0603EIA0603  [EIA0603]
C450  100nF/50V  C_0603EIA0603  [EIA0603]
C451  100nF/50V  C_0603EIA0603  [EIA0603]
C452  100nF/50V  C_0603EIA0603  [EIA0603]
C453  1uF/50V  C_0603EIA0603  [EIA0603]
C454  1uF/35V  C_0603EIA0603  [EIA0603]
C455  1uF/35V  C_0603EIA0603  [EIA0603]
C456  100nF/50V  C_0603EIA0603  [EIA0603]
C457  100nF/50V  C_0603EIA0603  [EIA0603]
C458  10uF/16V  C_0603EIA0603  [EIA0603]
IC401  CSTNE8M00G520000R0  [CSTNE8M00G520000R0]
R1  100R 1%  R_0603  [EIA0603]
R4  100R 1%  R_0603  [EIA0603]
R5  100R 1%  R_0603  [EIA0603]
R11  100R 1%  R_0603  [EIA0603]
R12  100R 1%  R_0603  [EIA0603]
R13  0R 1%  R_0603  [EIA0603]
R14  10K 1%  R_0603  [EIA0603]
R447  100R 1%  R_0603  [EIA0603]
R448  100R 1%  R_0603  [EIA0603]
R449  10K 1%  R_0603  [EIA0603]
U2  R7FA6M5BG3CFBLQFP-144-M  [LQFP-144-M]
V1  0603ESDA-24NSMD  [EIA0603]
V2  0603ESDA-24NSMD  [EIA0603]
V3  0603ESDA-24NSMD  [EIA0603]
X400  2304-6111-TP  [X04_100MIL]
X401  2304-6111-TP  [X04_100MIL]
X402  2304-6111-TP  [X04_100MIL]

### Nets
/DO_COMM_RX_EN: U2.35(A:P408)
AI_I_OUT: U2.113(B:P500)
DI_G_DRV_RDY: C400.2 R448.1 U2.85(B:P610) X400.2 ; also sheet 3
DI_UART_RX: U2.32(A:P411)
DO_ABRUPT_I_OFF: U2.118(B:P505) ; also sheet 3
DO_COMM_TX_EN: U2.34(A:P409)
DO_I_SET_PWM: U2.97(B:P601) V3.2 X401.2
DO_PSFB_CTRL_ON: U2.98(B:P600)
DO_UART_TX: U2.33(A:P410)
DO_V_SET_PWM: V2.2 X401.3
GND: C1.1 C2.1 C5.1 C6.1 C400.1 C401.1 C402.1 C439.1 C440.2 C441.2 C442.1 C443.1 C444.1 C445.2 C446.2 C447.2 C450.2 C451.1 C452.2 C453.2 C454.2 C455.2 C456.2 C457.2 C458.2 IC401.2(GND) U2.18(A:VSS_2) U2.48(A:VSS_3) U2.67(A:VSS) U2.82(B:VSS_2) U2.91(B:VSS_3) U2.100(B:VSS_4) U2.112(B:VSS_5) U2.122(B:VSS_6) U2.125(B:VREFL) U2.128(B:AVSS0) U2.141(B:VSS) V1.1 V2.1 V3.1 X400.4 X401.1 ; also sheet 1,2,3
N$111: C451.2 U2.15(A:VCL0)
N$112: C454.1 C456.1 U2.127(B:AVCC0)
N$113: C452.1 U2.92(B:VCL)
N$114: IC401.3(OUTPUT) R14.2 U2.20(A:P212/EXTAL)
N$115: IC401.1(INPUT) R13.2 R14.1
N$116: R13.1 U2.19(A:P213/XTAL)
N$117: U2.63(A:P307)
N$118: U2.64(A:P306)
N$119: U2.65(A:P305)
N$120: U2.66(A:P304)
N$121: U2.69(A:P303)
N$122: U2.70(A:P302)
N$123: U2.71(A:P301)
N$124: U2.72(A:P300/TCK/SWCLK)
NDI_G_DRV_FAULTA: C1.2 R4.1 U2.89(B:P614) X402.1
NDI_G_DRV_FAULTB: C2.2 R5.1 U2.88(B:P613) X402.2
NDI_G_DRV_FAULTC: C5.2 R11.1 U2.87(B:P612) X402.3
NDI_G_DRV_FAULTD: C6.2 R12.1 U2.86(B:P611) X402.4
NDO_G_DRV_RST: C402.2 R447.1 U2.93(B:P605) X400.1 ; also sheet 3
NDO_PSFB_CTRL_ON: R1.2
NRST: C450.1 R449.2 U2.55(A:RES)
PSFB_EN: R1.1 V1.2 X401.4 ; also sheet 3
V_3V3: C401.2 C439.2 C440.1 C441.1 C442.2 C443.2 C444.2 C445.1 C446.1 C447.1 C453.1 C455.1 C457.1 C458.1 R4.2 R5.2 R11.2 R12.2 R447.2 R448.2 R449.1 U2.21(A:VCC_2) U2.49(A:VCC_3) U2.68(A:VCC) U2.81(B:VCC_2) U2.90(B:VCC_3) U2.99(B:VCC_4) U2.111(B:VCC_5) U2.121(B:VCC_6) U2.126(B:VREFH) U2.142(B:VCC) X400.3 ; also sheet 2,3
Unconnected: U2.1(A:P400) U2.2(A:P401) U2.3(A:P402) U2.4(A:P403) U2.5(A:P404) U2.6(A:P405) U2.7(A:P406) U2.8(A:P700) U2.9(A:P701) U2.10(A:P702) U2.11(A:P703) U2.12(A:P704) U2.13(A:P705) U2.16(A:XCIN) U2.17(A:XCOUT) U2.22(A:P713) U2.23(A:P712) U2.24(A:P711) U2.25(A:P710) U2.26(A:P709) U2.27(A:P708) U2.28(A:P415) U2.29(A:P414) U2.30(A:P413) U2.31(A:P412) U2.36(A:P407) U2.38(A:USB_DM) U2.39(A:USB_DP) U2.41(A:P207) U2.42(A:P206) U2.43(A:P205) U2.44(A:P204) U2.45(A:P203) U2.46(A:P202) U2.47(A:P313) U2.50(A:P214) U2.51(A:P211) U2.52(A:P210) U2.53(A:P209) U2.54(A:P208) U2.56(A:P201/MD) U2.57(A:P200) U2.58(A:P312) U2.59(A:P311) U2.60(A:P310) U2.61(A:P309) U2.62(A:P308) U2.73(B:P108/TMS/SWDIO) U2.74(B:P109/TDO) U2.75(B:P110/TDI) U2.76(B:P111) U2.77(B:P112) U2.78(B:P113) U2.79(B:P114) U2.80(B:P115) U2.83(B:P608) U2.84(B:P609) U2.94(B:P604) U2.95(B:P603) U2.96(B:P602) U2.101(B:P107) U2.102(B:P106) U2.103(B:P105) U2.104(B:P104) U2.105(B:P103) U2.106(B:P102) U2.107(B:P101) U2.108(B:P100) U2.109(B:P800) U2.110(B:P801) U2.114(B:P501) U2.115(B:P502) U2.116(B:P503) U2.117(B:P504) U2.119(B:P506) U2.120(B:P507) U2.123(B:P015) U2.124(B:P014) U2.131(B:P009) U2.132(B:P008) U2.133(B:P007) U2.134(B:P006) U2.135(B:P005) U2.136(B:P004) U2.137(B:P003) U2.138(B:P002) U2.139(B:P001) U2.140(B:P000) U2.143(B:P512) U2.144(B:P511)

## Power pins joined to a net without a drawn wire
VBATT: U2.14(A:VBATT)
VCC_USBHS: U2.40(A:VCC_USBHS)
VREFH0: U2.130(B:VREFH0)
VREFL0: U2.129(B:VREFL0)
VSS_USB: U2.37(A:VSS_USB)

## Library data of the parts
C1-C7 C10-C12 C15 C18 C19 C22 C200 C203 C206 C210 C300-C302 C305 C306 C311-C320 C323-C325 C328-C336 C339 C340 C342-C359 C362 C365-C386 C388-C392 C394-C402 C409 C410 C412-C418 C421-C433 C435 C436 C439-C447 C450-C458 = Labops_Lib_AH:C_0603
C100 C101 C103-C106 = Labops_Lib_AH:SLP152M250H9P3; DESCRIPTION: 1500µF, 250V, Radial, 3000HRS; MFN: SLP152M250H9P3; MFR: Cornell; PART_VALUE: 1500uF/250V
C102 = Labops_Lib_AH:R49AN347050B1M: 0.47µF X Cap 330V 800V Polypropylene (PP), Metallized Radial; DESCRIPTION: Film,X1,470nF/330Vac,THT; LIB_STATUS: Verified; MFN: R49AN347050B1M; MFR: Kemet; OUR_STOCK: 8; PART_VALUE: 470nF/330VAC; PRICE-1: 1.51; SUPPLIER-1: Digikey
C108 = Labops_Lib_AH:ERP610W471MEF0; DESCRIPTION: 470 pF ±20% 760VAC Ceramic Capacitor Y5U (E) Radial X1,Y1; LIB_STATUS: Prototype; MFN: ERP610W471MEF0; MFR: Kemet; OUR_STOCK: 150; PART_VALUE: 470pF/760VAC; PRICE-1: 0.42; SUPPLIER-1: Digikey
C201 C202 C205 C207 C211 C393 = Labops_Lib_AH:50PX470MEFC10X20: Electrolytic Cap, 470µF, 25V, Low ESR, Kemet, Pitch=5mm, Dia=10mm, L=12,5mm; DESCRIPTION: 470uF ±20% 50V 10mm 20mm 5mm 2000Hrs @ 105℃ -55℃ ~ +105℃; LIB_STATUS: Prototype; MFN: 50PX470MEFC10X20; MFR: Rubicon; OUR_STOCK: 20; PART_VALUE: 470uF/50V; PRICE-1: 0.14; SUPPLIER-1: LCSC; TECHNOLOGY: THT
C303 C304 C307 C308 = Labops_Lib_AH:HVCC153Y6P471MEAX; DESCRIPTION: 470pF/15KV, 12.5mm pitch, THT; MFN: HVCC153Y6P471MEAX; MFR: Vishay; PART_VALUE: 470pF/15KV
C419 C420 = Labops_Lib_AH:CK45-B3FD102KYVNA; DESCRIPTION: 1nF/3KV, THT 7.5mm pitch, TDK; MFN: CK45-B3FD102KYVNA; MFR: TDK; PART_VALUE: 1nF/3KV
C437 C438 = Labops_Lib_AH:ECW-F4245JLB; DESCRIPTION: 2.4uF ±5% 400V Film Capacitor Radial,MPP; MFN: ECW-F4245JLB; MFR: Panasonic; PART_VALUE: 2.4uF/400V
D1 D315 D317 D319 D320 D322 = Labops_Lib_AH:SD103AW; DESCRIPTION: Schottky 40V 350mA 600mV @ 200mA SOD-123; MFN: SD103AW; MFR: Onsemi, Guanddong Hottech; PART_VALUE: 350mA, 40V
D2 D302 D316 D318 = Labops_Lib_AH:SS14; DESCRIPTION: Diode Schottky 1A/40V (SMA); LIB_STATUS: Prototype; MFN: SS14-LTP; MFR: MCC; OUR_STOCK: 10; PART_VALUE: Schottky 1A/40V; PRICE-1: 0.05; SUPPLIER-1: LCSC
D4 D300 D303-D305 D323 = Labops_Lib_AH:STTH1R04U; DESCRIPTION: 1A, 400V, SMB, Fast Recovery; MFN: STTH1R04U; PART_VALUE: STTH1R04U
D100 D103 = Labops_Lib_AH:RS1M-13-F; DESCRIPTION: Gen Purpose , 1KV,1A, 500ns, SMA; LIB_STATUS: Prototype; MFN: RS1M-13-F; MFR: Diodes; OUR_STOCK: 10; PART_VALUE: RS1M-13-F; PRICE-1: 0.07; SUPPLIER-1: LCSC
D101 = Labops_Lib_AH:GBPC3510W: BRIDGE RECT 1xPhase 1KV 35A GBPC-W Package; DESCRIPTION: Bridge 1x Phase 1KV 35A; MFN: GBPC3510W; PART_VALUE: GBPC3510W
D102 = Labops_Lib_AH:1N5387BRLG; DESCRIPTION: ±5% 190V 500nA @ 144V 5W Axial Zener Diodes; LIB_STATUS: Prototype; MFN: 1N5387BRLG; MFR: On Semi; OUR_STOCK: 20; PART_VALUE: 190V 5W; PRICE-1: 0.38; SUPPLIER-1: LCSC
D104 D105 = Labops_Lib_AH:1N4739A; DESCRIPTION: Zener, 9.1V, 5%,1.6Watt, Axial DO-41; MFN: 1N4739A; PART_VALUE: 1N4739A
D200 D201 = Labops_Lib_AH:26-21/GPC-F3138B/CA; DESCRIPTION: Green SMD LED 1206, 160mcd; LIB_STATUS: Prototype; MFN: 26-21/GPC-F3138B/CA; MFR: Everlight; OUR_STOCK: 50; PART_VALUE: Green LED; PRICE-1: 0.06; SUPPLIER-1: LCSC
D307-D312 = Labops_Lib_AH:FEP30DP-E3/45; DESCRIPTION: Dual Diode, Fast Recovery, 15A,600V, Common Cathode, TO-247AD; MFN: FEP30JP-E3/45; PART_VALUE: Diode 2x15A
D313 D413 = Labops_Lib_AH:GB02SLT12-214; DESCRIPTION: Schottky SiC, 1.2KV, 2A SMB; MFN: GB02SLT12-214; MFR: GeneSic; PART_VALUE: 2A, 1.2KV
D324 = Labops_Lib_AH:BAT54S; DESCRIPTION: 200mA, 30V, SOT23, Schottky; MFN: BAT54S; MFR: HT; PART_VALUE: 200mA,30V
IC1 = Labops_Lib_AH:UCC28951PWR: Phase Shift Full Bridge SMPS Controller, TI, TSSOP-24; DESCRIPTION: Phase Shift Full Bridge Controller, TSSOP24; MFN: UCC28951QPWRQ1; MFR: Texas Instruments; PART_VALUE: UCC28951
IC2 IC301 IC302 = Labops_Lib_AH:LMV641: Opamp, 1MHz, SOT23-5, One Channel, Rail-Rail; DESCRIPTION: 1CH 10MHz 1 Low power 2.3 V/us 2.7V~12V SOT-23-5 OpAmp; MFN: LMV641MF/NOPB; MFR: Texas Instruments; PACKAGE: SOT23-5; PART_VALUE: LMV641
IC100 = Labops_Lib_AH:PC817; DESCRIPTION: Optocoupler, 1CH, DIP04, 5KV; LIB_STATUS: Prototype; MFN: PC817; MFR: Sharp, UTC; OUR_STOCK: 20; PART_VALUE: PC817; PRICE-1: 0.05; SUPPLIER-1: LCSC
IC306 IC307 IC310 IC311 = Labops_Lib_AH:UCC21710; DESCRIPTION: Isolated Gate Driver SOIC16; MFN: UCC21710QDWQ1; PART_VALUE: UCC21710
IC308 IC309 = Labops_Lib_AH:MAX764CSA+; DESCRIPTION: Switching Regulator, Inverting, -5V/Adj SOIC8, Vin 3-16.5V; MFN: MAX764CSA+; MFR: Max IC; OUR_STOCK: 30; PART_VALUE: Buck/Boost IC; PRICE-1: 4.0; SUPPLIER-1: Mouser
IC312 IC313 = Labops_Lib_AH:LM317AEMP: Linear Voltage Regulator IC Positive Adjustable Output 1.5A SOT-223-4; DESCRIPTION: LDO VIN 1.25 to 37V SOT223; MFN: LM317AEMPX/NOPB; PART_VALUE: LM317
IC401 = Labops_Lib_AH:CSTNE8M00G520000R0: 8.000MHz ±0.50% Ceramic Resonator with Built in Capacitor 10pF 40Ω Stability ±0.20% 3-SMD; DESCRIPTION: 8MHz ±0.5% 10pF 40Ω SMD3213-3P Ceramic Resonators; LIB_STATUS: Prototype; MFN: CSTNE8M00G520000R0; MFR: Murata; PART_VALUE: 8MHz, 0.5%; PRICE-1: 0.12; SUPPLIER-1: LCSC
K100 K101 = Labops_Lib_AH:PANASONIC_ALFG2PF09: Relay 31A, 9V, SPST-NO (1 Form A) Panasonic; CIIVA_IDS: 1180488; COIL_VOLTAGE: 9 V; COMPONENT_LINK_1_DESCRIPTION: Manufacturer URL; COMPONENT_LINK_1_URL: http://www3.panasonic.biz/ac/ae/index.jsp; COMPONENT_LINK_3_DESCRIPTION: Package Specification; COMPONENT_LINK_3_URL: http://www3.panasonic.biz/ac/e_download/control/relay/power/catalog/mech_eng_lfg.pdf?f_cd=300272; DATASHEET: http://www3.panasonic.biz/ac/e_download/control/relay/power/catalog/mech_eng_lfg.pdf?f_cd=300272; DATASHEET_VERSION: 201402-T; ELECTRICAL_LIFE: 3x10^4; FOOTPRINT_VARIANT_NAME_0: Manufacturer Recommended; IMPORTED: yes; IMPORTED_FROM: vault; IMPORT_TS: 1521844845; MAX_SWITCHING_CURRENT: 31 A AC; MAX_SWITCHING_VOLTAGE: 250 V AC; MECHANICAL_LIFEMINOPERATION: 1x10^6; MF: Panasonic; MOUNTING_TECHNOLOGY: Through Hole; MPN: ALFG2PF09; NOMINAL_OPERATING_POWER: 1400 mW; PACKAGE: LF-G-4-3010x1570x2330; PACKAGE_DESCRIPTION: 4-Pin Through Hole Terminal Package, Body 30.1 x 15.7 mm; PACKAGE_VERSION: ASCTB196E, 02/2014; PACKING: Carton, Case; PB__FREE: true; PREFIX: K; RELEASE_DATE: 1421744840; SERIES: LF-G Relays; VAULT_GUID: 49A0321D-630D-49EF-B2C8-0308632C255A; VAULT_REVISION: 10808CD6-6A28-402B-B998-FC10EF34438A
L300 L302 L304 L308 L309 = Labops_Lib_AH:BLM18RK601SN1D; DESCRIPTION: 600 Ohms @ 100 MHz 1 - Ferrite Bead 0603; LIB_STATUS: Prototype; MFN: BLM18RK601SN1D; MFR: Murata; OUR_STOCK: 100; PART_VALUE: 600R@100MHz; PRICE-1: 0.05; SUPPLIER-1: Digikey
L303 L307 = Labops_Lib_AH:SRN8040TA-220M: FIXED IND 22UH 2.9A SMD, 73m-Ohm, Bourns; DESCRIPTION: FIXED IND 22UH 2.9A SMD, 73m-Ohm, Bourns; LIB_STATUS: Verified; MFN: SRN8040TA-220M; MFR: Bourns; OUR_STOCK: 10; PART_VALUE: 22uH/2.9A; SUPPLIER-1: Digikey; TECHNOLOGY: SMD
Q1 Q2 Q300 Q306-Q310 = Labops_Lib_AH:2N7002; DESCRIPTION: NMOSFET, 500mA, 60V, Vth 2.5V; LIB_STATUS: Prototype; MFN: 2N7002; MFR: Diodes, Guangdong Hotetech,NXP; OUR_STOCK: 100; PART_VALUE: NMOSFET; PRICE-1: 0.02; SUPPLIER-1: LCSC
Q100 = Labops_Lib_AH:BC640TA; DESCRIPTION: Bipolar (BJT) Transistor PNP 80 V 1 A 100MHz 1 W Through Hole TO-92-3; LIB_STATUS: Prototype; MFN: BC640TA; MFR: On Semi,; OUR_STOCK: 20; PART_VALUE: BC640TA; PRICE-1: 0.32; SUPPLIER-1: Digikey
Q101 = Labops_Lib_AH:KSD1616AYTA; DESCRIPTION: NPN 60 V 1 A 160MHz 750 mW Through Hole TO-92-3; LIB_STATUS: Prototype; MFN: KSD1616AYTA; MFR: On Semi; OUR_STOCK: 0; PART_VALUE: NPN; PRICE-1: 0.35; SUPPLIER-1: Digikey
R1-R14 R29-R31 R106 R107 R109 R110 R200 R201 R300 R303 R305-R309 R312 R314 R315 R328 R331 R333-R339 R341-R371 R373-R384 R386 R388-R391 R397 R399 R400 R402-R412 R416-R423 R425 R426 R428-R436 R438 R447-R449 R461-R463 = Labops_Lib_AH:R_0603; MFN: Open Source 0603
R100 R112 = Labops_Lib_AH:B57364S100M54: NTC Inrush Current Limiter
R101 R103 = Labops_Lib_AH:R_1206; MFN: Open Source R1206
R102 R104 = Labops_Lib_AH:ERG-2SJ513; DESCRIPTION: RES 51K OHM 5% 2W AXIAL; MFN: ERG-2SJ513; MFR: Panasonic; PART_VALUE: 51K 3%
R105 = Labops_Lib_AH:R_2010; PRICE-1: 0.11; SUPPLIER-1: Digikey
R108 R113 = Labops_Lib_AH:R_2010; MFN: Open Source R 2010; PART_VALUE: 18R 1%
R111 = Labops_Lib_AH:R_1206; MFN: Open Source R1206; PART_VALUE: 1K 1%
R114 R115 R326 R398 = Labops_Lib_AH:RNF12FTD10M0; DESCRIPTION: 10 MOhms ±1% 0.5W, 1/2W Through Hole Resistor Axial Flame Retardant Coating, Safety Metal Film; LIB_STATUS: Prototype; MFN: RNF12FTD10M0; MFR: Stackpole Electronics Inc; OUR-STOCK: 20; PART_VALUE: 10Meg 5%; PRICE-1: 0.29; SUPPLIER-1: Digikey
R301 R302 R310 R311 R322 R323 R329 R330 = rcl:R-US_: RESISTOR, American symbol; SPICEPREFIX: R
R304 R313 R325 R327 R332 R385 R387 R396 = Labops_Lib_AH:R_2010; MFN: Open Source R 2010
R316 R372 R401 R424 R427 = Labops_Lib_AH:R_2512
R340 = Labops_Lib_AH:WSL5931L3000FEA; DESCRIPTION: 300 µOhms ±1% 5W Chip Resistor Nonstandard Anti-Sulfur, Automotive AEC-Q200, Current Sense, Moisture Resistant, Pulse Withstanding Metal Element; LIB_STATUS: Verified; MFN: WSL5931L3000FEA; MFR: Vishay; OUR_STOCK: 5; PART_VALUE: 300uR 1% 5W; PRICE-1: 2.1; SUPPLIER-1: Digikey
R439-R442 = Labops_Lib_AH:RR02J22RTB; DESCRIPTION: 22R,5%,2W, THT, 15mm pitch; MFN: RR02J22RTB; MFR: TE Connectivity; PRICE-1: 0.4
T1 = Labops_Lib_AH:CST206-2A: Current sense transformer, Iprim_max=80A RMS. 20-200KHz, Triag Magnetics; DESCRIPTION: Transformer; Current Sense; Config Encapsulated; 1; Freq 20-200kHz; Pri 80A; PCB; LIB_STATUS: verified; MFN: CST206-2A; MFR: Trriad Magnetics; OUR_STOCK: 8; PART_VALUE: 1:200, 80A; PRICE-1: 5.5; SUPPLIER-1: Digikey
T300 T301 T303 T304 = Labops_Lib_AH:IHW20N120R5; DESCRIPTION: IGBT 20A 1200V TO247; MFN: IHW20N120R5; MFR: Infineon; PACKAGE: TO247-AC; PART_VALUE: IHW20N120R5
TR305 = Labops_Lib_AH:11-0060-A; DESCRIPTION: 4KW Full Bridge Transformer, THT; MFN: 11-0060-A; MFR: Dongguan Speed Electronics
U2 = Labops_Lib_AH:R7FA6M5BG3CFB; MFN: R7FA6M5BG3CFB#AA0; MFR: Renesas
U300 U301 = Labops_Lib_AH:PAD_3MMX6MM; DESCRIPTION: PAD 3mm x 6mm; MFN: PCB PAD 3mm x 6mm; MFR: NA; PART_VALUE: PAD 3mmx6mm
V1-V3 = Labops_Lib_AH:0603ESDA-24N; DESCRIPTION: aristor 0603 SMD Bidirectional 50V 24V; MFN: 0603ESDA-24N; MFR: Bourns; SUPPLIER-1: LCSC
V100 V300 = Labops_Lib_AH:B72205S0271K101: VARISTOR 205V 800A DISC 5MM; LIB_STATUS: Verified; MFN: B72205S0271K1011; MFR: EPCOS; OUR_STOCK: 10; PART_VALUE: 430V, 400A; PRICE-1: 0.31; SUPPLIER-1: Digikey
X100 X101 = Labops_Lib_AH:01020071Z; DESCRIPTION: Fuse Clip, 1/4" Fuses, Littlefuse, THT; MFN: 01020071Z; MFR: LittleFuse
X200-X203 = Labops_Lib_AH:726386-2: Terminals, Faston, GDS-Flachstecker 6.3x0.8mm, TE; CENTROID_NOT_SPECIFIED: No; CONN_GENDER: Male; CONN_ORIENTATION: Straight; CONTACT_MATERIAL: Tin; DATASHEET: http://www.te.com/commerce/DocumentDelivery/DDEController?Action=showdoc&DocId=Customer+Drawing%7F726386%7FG%7Fpdf%7FEnglish%7FENG_CD_726386_G.pdf%7F726386-2; DEVICE_CLASS_L1: Connectors; DEVICE_CLASS_L2: Terminal Blocks | Terminals; DEVICE_CLASS_L3: unset; DIGIKEY_DESCRIPTION: CONN QC TAB 0.250 SOLDER; DIGIKEY_PART_NUMBER: A114371-ND; HEIGHT: 10mm; LEAD_FREE: yes; MF: TE; MFG_PACKAGE_IDENT: 726386-2; MFG_PACKAGE_IDENT_DATE: 0; MFG_PACKAGE_IDENT_REV: 0; MOUSER_DESCRIPTION: Terminals GDS-FLACHSTECK 6.3; MOUSER_PART_NUMBER: 571-726386-2; MPN: 726386-2; PACKAGE: PTH_TERMINAL_8MM0_0MM8; PREFIX: J; ROHS: yes; TEMPERATURE_RANGE_HIGH: +110°C; TEMPERATURE_RANGE_LOW: -30°C; VERIFICATION_VERSION: 0.0.0.1
X204 X205 = Labops_Lib_AH:MOLEX_206832-0601: Connector Header Through Hole 6 position 0.118" (3.00mm); DESCRIPTION: Connector Header Through Hole 6 position 3mm Microfit; LIB_STATUS: Prototype; MFN: 206832-0601; MFR: Molex; OUR_STOCK: 20; PART_VALUE: 6CCT x 2Row; PRICE-1: 1.32; SUPPLIER-1: Digikey
X400-X402 = Labops_Lib_AH:2304-6111-TP; DESCRIPTION: 4 Pin THT Connector 100 mil pitch; MFN: 2304-6111-TP; MFR: 3M; PART_VALUE: X04 Connector 100mil